# Altium project KaRadioWired.PrjPcb (part 1 of 2)
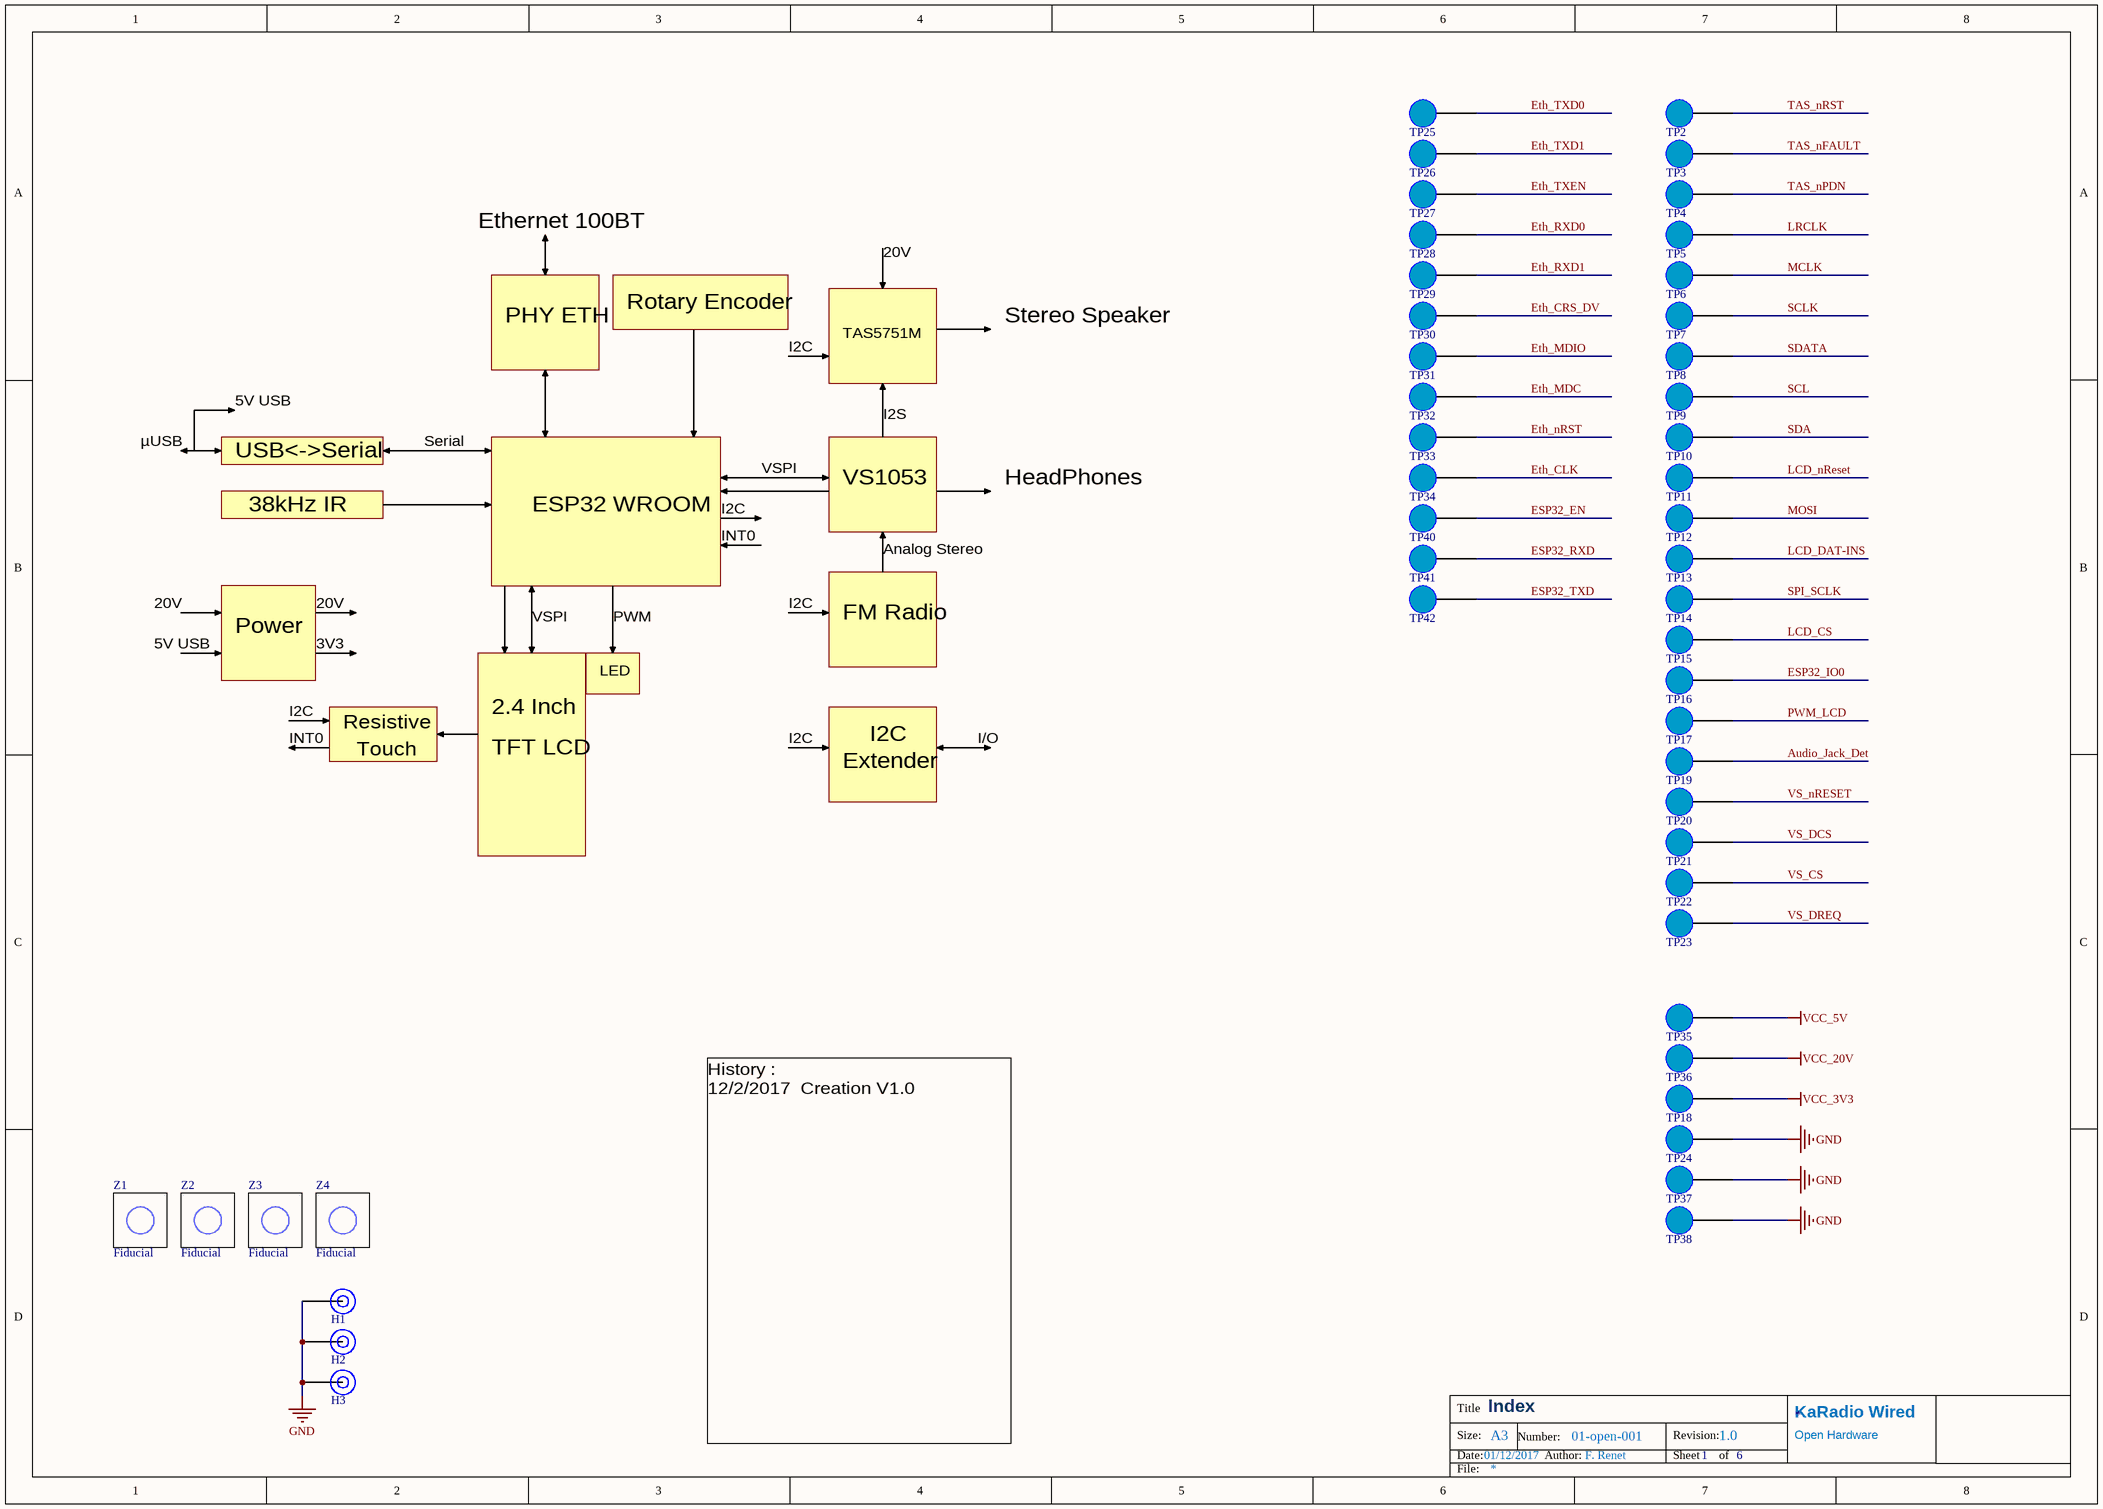
[diagram p0: 00-INDEX.SchDoc]
Organisation: APTUSTECH; ProjectAuthor: F. Renet; ProjectDate: 01/12/2017; ProjectName: KaRadio Wired; ProjectNumber: 01-open-001; ProjectRevision: 1.0; ProjectSubtitle: Open Hardware; ProjectTitle: KaRadio Wired
6 sheets, 271 parts. Net scope: global (net labels, ports and power ports of the same name join across sheets).
Board file: KaRadioWired.PcbDoc
Sheets:
  00-INDEX.SchDoc
  01-Amplifier.SchDoc
  02-ESP-WROOM-32.SchDoc
  03-VS1053B.SchDoc
  04-Ethernet.SchDoc
  05-Power.SchDoc

## Sheet 00-INDEX.SchDoc: Index
size A3; SheetNumber: 1; SheetTotal: 6

### Parts
H1  Hole_Screw_3mm  [Hole_3.2mm]  (value not drawn)  (no BOM)
H2  Hole_Screw_3mm  [Hole_3.2mm]  (value not drawn)  (no BOM)
H3  Hole_Screw_3mm  [Hole_3.2mm]  (value not drawn)  (no BOM)
TP2  TP_1mm  [TP_1mm]  (value not drawn)  (no BOM)
TP3  TP_1mm  [TP_1mm]  (value not drawn)  (no BOM)
TP4  TP_1mm  [TP_1mm]  (value not drawn)  (no BOM)
TP5  TP_1mm  [TP_1mm]  (value not drawn)  (no BOM)
TP6  TP_1mm  [TP_1mm]  (value not drawn)  (no BOM)
TP7  TP_1mm  [TP_1mm]  (value not drawn)  (no BOM)
TP8  TP_1mm  [TP_1mm]  (value not drawn)  (no BOM)
TP9  TP_1mm  [TP_1mm]  (value not drawn)  (no BOM)
TP10  TP_1mm  [TP_1mm]  (value not drawn)  (no BOM)
TP11  TP_1mm  [TP_1mm]  (value not drawn)  (no BOM)
TP12  TP_1mm  [TP_1mm]  (value not drawn)  (no BOM)
TP13  TP_1mm  [TP_1mm]  (value not drawn)  (no BOM)
TP14  TP_1mm  [TP_1mm]  (value not drawn)  (no BOM)
TP15  TP_1mm  [TP_1mm]  (value not drawn)  (no BOM)
TP16  TP_1mm  [TP_1mm]  (value not drawn)  (no BOM)
TP17  TP_1mm  [TP_1mm]  (value not drawn)  (no BOM)
TP18  TP_1mm  [TP_1mm]  (value not drawn)  (no BOM)
TP19  TP_1mm  [TP_1mm]  (value not drawn)  (no BOM)
TP20  TP_1mm  [TP_1mm]  (value not drawn)  (no BOM)
TP21  TP_1mm  [TP_1mm]  (value not drawn)  (no BOM)
TP22  TP_1mm  [TP_1mm]  (value not drawn)  (no BOM)
TP23  TP_1mm  [TP_1mm]  (value not drawn)  (no BOM)
TP24  TP_1mm  [TP_1mm]  (value not drawn)  (no BOM)
TP25  TP_1mm  [TP_1mm]  (value not drawn)  (no BOM)
TP26  TP_1mm  [TP_1mm]  (value not drawn)  (no BOM)
TP27  TP_1mm  [TP_1mm]  (value not drawn)  (no BOM)
TP28  TP_1mm  [TP_1mm]  (value not drawn)  (no BOM)
TP29  TP_1mm  [TP_1mm]  (value not drawn)  (no BOM)
TP30  TP_1mm  [TP_1mm]  (value not drawn)  (no BOM)
TP31  TP_1mm  [TP_1mm]  (value not drawn)  (no BOM)
TP32  TP_1mm  [TP_1mm]  (value not drawn)  (no BOM)
TP33  TP_1mm  [TP_1mm]  (value not drawn)  (no BOM)
TP34  TP_1mm  [TP_1mm]  (value not drawn)  (no BOM)
TP35  TP_1mm  [TP_1mm]  (value not drawn)  (no BOM)
TP36  TP_1mm  [TP_1mm]  (value not drawn)  (no BOM)
TP37  TP_1mm  [TP_1mm]  (value not drawn)  (no BOM)
TP38  TP_1mm  [TP_1mm]  (value not drawn)  (no BOM)
TP40  TP_1mm  [TP_1mm]  (value not drawn)  (no BOM)
TP41  TP_1mm  [TP_1mm]  (value not drawn)  (no BOM)
TP42  TP_1mm  [TP_1mm]  (value not drawn)  (no BOM)
Z1  Fiducial  [Fiducial_1mm]  (no BOM)
Z2  Fiducial  [Fiducial_1mm]  (no BOM)
Z3  Fiducial  [Fiducial_1mm]  (no BOM)
Z4  Fiducial  [Fiducial_1mm]  (no BOM)

### Nets
GND: H1.1 H2.1 H3.1 TP24.1 TP37.1 TP38.1
VCC_3V3: TP18.1
VCC_5V: TP35.1
VCC_20V: TP36.1
Audio_Jack_Det: TP19.1
ESP32_EN: TP40.1
ESP32_IO0: TP16.1
ESP32_RXD: TP41.1
ESP32_TXD: TP42.1
Eth_CLK: TP34.1
Eth_CRS_DV: TP30.1
Eth_MDC: TP32.1
Eth_MDIO: TP31.1
Eth_nRST: TP33.1
Eth_RXD0: TP28.1
Eth_RXD1: TP29.1
Eth_TXD0: TP25.1
Eth_TXD1: TP26.1
Eth_TXEN: TP27.1
LCD_CS: TP15.1
LCD_DAT-INS: TP13.1
LCD_nReset: TP11.1
LRCLK: TP5.1
MCLK: TP6.1
MOSI: TP12.1
PWM_LCD: TP17.1
SCL: TP9.1
SCLK: TP7.1
SDA: TP10.1
SDATA: TP8.1
SPI_SCLK: TP14.1
TAS_nFAULT: TP3.1
TAS_nPDN: TP4.1
TAS_nRST: TP2.1
VS_CS: TP22.1
VS_DCS: TP21.1
VS_DREQ: TP23.1
VS_nRESET: TP20.1

### Notes on the sheet
- Ethernet 100BT
- Rotary Encoder
- 20V
- PHY ETH
- I2C
- TAS5751M
- Stereo Speaker
- µUSB
- 5V USB
- Serial
- I2S
- USB<->Serial
- 38kHz IR
- ESP32 WROOM
- VSPI
- VS1053
- HeadPhones
- INT0
- Analog Stereo
- Power
- 3V3
- PWM
- FM Radio
- 2.4 Inch
- LED
- Resistive
- Touch
- TFT LCD
- Extender
- I/O
- History :
  12/2/2017  Creation V1.0
- Title
- Size:
- Date:
- A3
- Number:
- Author:
- Revision:
- Sheet
- of
- File:

### Library data of the parts
H1-H3 = Hole_Screw_3mm: Fix hole 3mm screw
TP2-TP38 TP40-TP42 = TP_1mm: Test point 1mm round SMD
Z1-Z4 = Fiducial: 1mm Fiducial

## Sheet 01-Amplifier.SchDoc: Amplifier TAS5751M
size A3; SheetNumber: 2; SheetTotal: 6
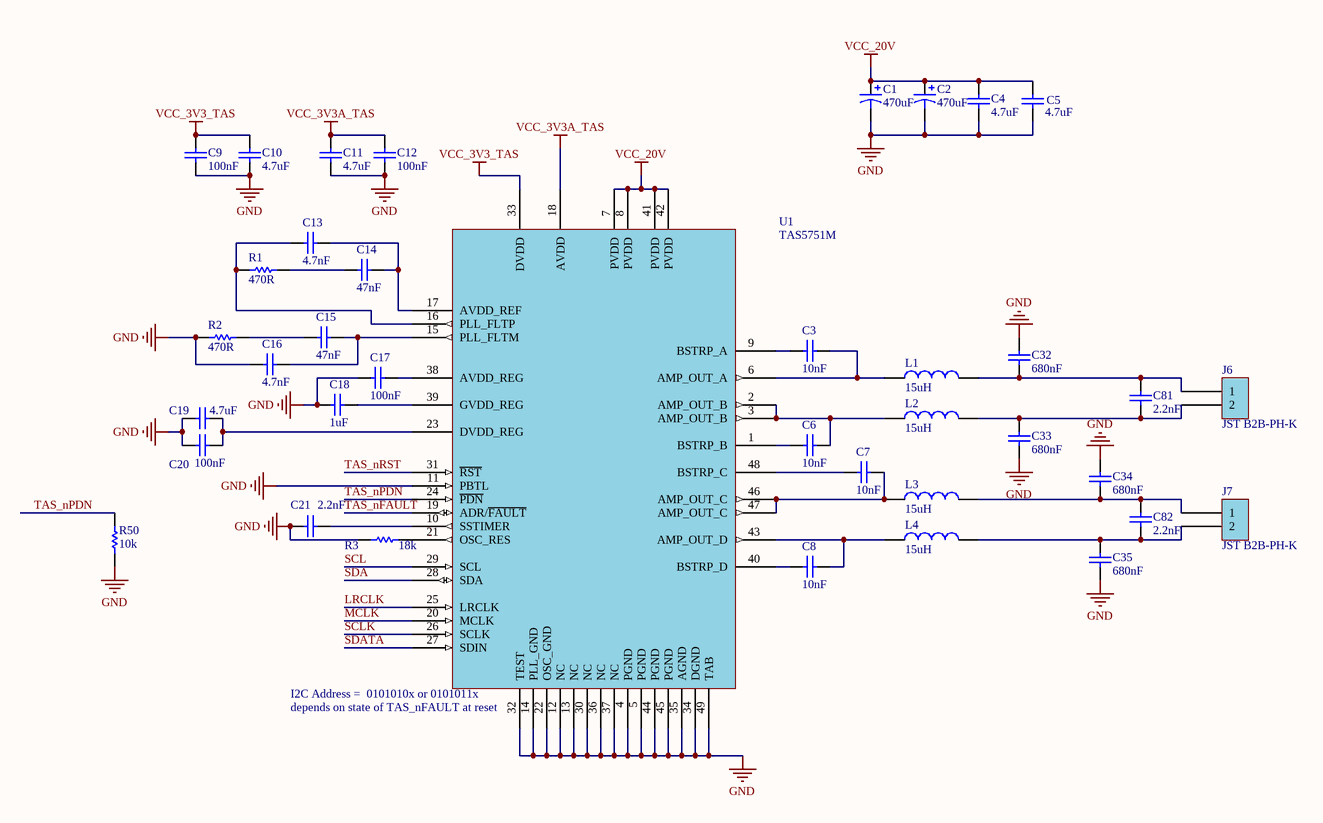
[diagram p1: 01-Amplifier.SchDoc]

### Parts
C1  value 470uF  [Cap_POL_10mm_12.5mm_TH]  (hidden comment: 470uF 25V)
C2  value 470uF  [Cap_POL_10mm_12.5mm_TH]  (hidden comment: 470uF 25V)
C3  value 10nF  [CAPC3216X16N]  (hidden comment: 10nF 50V 1206 X7R)
C4  value 4.7uF  [CAPC3216X16N]  (hidden comment: 4.7uF 50V 1206 X5R)
C5  value 4.7uF  [CAPC3216X16N]  (hidden comment: 4.7uF 50V 1206 X5R)
C6  value 10nF  [CAPC3216X16N]  (hidden comment: 10nF 50V 1206 X7R)
C7  value 10nF  [CAPC3216X16N]  (hidden comment: 10nF 50V 1206 X7R)
C8  value 10nF  [CAPC3216X16N]  (hidden comment: 10nF 50V 1206 X7R)
C9  value 100nF  [CAPC1608X06N]  (hidden comment: 100nF 25V 0603 X5R)
C10  value 4.7uF  [CAPC1608X06N]  (hidden comment: 4.7uF 10V 0603 X5R)
C11  value 4.7uF  [CAPC1608X06N]  (hidden comment: 4.7uF 10V 0603 X5R)
C12  value 100nF  [CAPC1608X06N]  (hidden comment: 100nF 25V 0603 X5R)
C13  value 4.7nF  [CAPC1608X06N]  (hidden comment: 4.7nF 50V 0603 X7R)
C14  value 47nF  [CAPC1608X06N]  (hidden comment: 47nF 50V 0603 X7R)
C15  value 47nF  [CAPC1608X06N]  (hidden comment: 47nF 50V 0603 X7R)
C16  value 4.7nF  [CAPC1608X06N]  (hidden comment: 4.7nF 50V 0603 X7R)
C17  value 100nF  [CAPC1608X06N]  (hidden comment: 100nF 25V 0603 X5R)
C18  value 1uF  [CAPC1608X06N]  (hidden comment: 1uF 16V 0603 X7R)
C19  value 4.7uF  [CAPC1608X06N]  (hidden comment: 4.7uF 10V 0603 X5R)
C20  value 100nF  [CAPC1608X06N]  (hidden comment: 100nF 25V 0603 X5R)
C21  value 2.2nF  [CAPC1608X06N]  (hidden comment: 2.2nF 50V 0603 X7R)
C32  value 680nF  [CAPC3216X16N]  (hidden comment: 680nF 50V 1206 C0G)
C33  value 680nF  [CAPC3216X16N]  (hidden comment: 680nF 50V 1206 C0G)
C34  value 680nF  [CAPC3216X16N]  (hidden comment: 680nF 50V 1206 C0G)
C35  value 680nF  [CAPC3216X16N]  (hidden comment: 680nF 50V 1206 C0G)
C81  value 2.2nF  [CAPC1608X06N]  (hidden comment: 2.2nF 50V 0603 X7R)
C82  value 2.2nF  [CAPC1608X06N]  (hidden comment: 2.2nF 50V 0603 X7R)
J6  JST B2B-PH-K  [JST B2B-PH-K]
J7  JST B2B-PH-K  [JST B2B-PH-K]
L1  value 15uH  [1255AY]  (hidden comment: 1255AY-150M)
L2  value 15uH  [1255AY]  (hidden comment: 1255AY-150M)
L3  value 15uH  [1255AY]  (hidden comment: 1255AY-150M)
L4  value 15uH  [1255AY]  (hidden comment: 1255AY-150M)
R1  value 470R  [RESC1608X06N]  (hidden comment: 470R_0603)
R2  value 470R  [RESC1608X06N]  (hidden comment: 470R_0603)
R3  value 18k  [RESC1608X06N]  (hidden comment: 18k_0603)
R50  value 10k  [RESC1608X06N]  (hidden comment: 10k_0603)
U1  TAS5751M  [TSSOP50P810X120_HS-49M]

### Nets
GND: C1.2 C2.2 C4.1 C5.1 C9.1 C10.1 C11.1 C12.1 C16.1 C17.2 C18.1 C19.2 C20.2 C21.1 C32.1 C33.1 C34.1 C35.1 R2.1 R3.1 R50.2 U1.4(PGND) U1.5(PGND) U1.11(PBTL) U1.12(NC) U1.13(NC) U1.14(PLL_GND) U1.22(OSC_GND) U1.30(NC) U1.32(TEST) U1.34(DGND) U1.35(AGND) U1.36(NC) U1.37(NC) U1.44(PGND) U1.45(PGND) U1.49(TAB)
VCC_3V3_TAS: C9.2 C10.2 U1.33(DVDD)
VCC_3V3A_TAS: C11.2 C12.2 U1.18(AVDD)
VCC_20V: C1.1 C2.1 C4.2 C5.2 U1.7(PVDD) U1.8(PVDD) U1.41(PVDD) U1.42(PVDD)
LRCLK: U1.25(LRCLK)
MCLK: U1.20(MCLK)
SCL: U1.29(SCL)
SCLK: U1.26(SCLK)
SDA: U1.28(SDA)
SDATA: U1.27(SDIN)
TAS_nFAULT: U1.19(ADR/~{FAULT})
TAS_nPDN: R50.1 U1.24(~{PDN})
TAS_nRST: U1.31(~{RST})
NetC3_1: C3.1 U1.9(BSTRP_A)
NetC3_2: C3.2 L1.1 U1.6(AMP_OUT_A)
NetC6_1: C6.1 U1.1(BSTRP_B)
NetC6_2: C6.2 L2.1 U1.2(AMP_OUT_B) U1.3(AMP_OUT_B)
NetC7_1: C7.1 U1.48(BSTRP_C)
NetC7_2: C7.2 L3.1 U1.46(AMP_OUT_C) U1.47(AMP_OUT_C)
NetC8_1: C8.1 U1.40(BSTRP_D)
NetC8_2: C8.2 L4.1 U1.43(AMP_OUT_D)
NetC13_1: C13.1 R1.1 U1.16(PLL_FLTP)
NetC13_2: C13.2 C14.2 U1.17(AVDD_REF)
NetC14_1: C14.1 R1.2
NetC15_1: C15.1 R2.2
NetC15_2: C15.2 C16.2 U1.15(PLL_FLTM)
NetC17_1: C17.1 U1.38(AVDD_REG)
NetC18_2: C18.2 U1.39(GVDD_REG)
NetC19_1: C19.1 C20.1 U1.23(DVDD_REG)
NetC21_2: C21.2 U1.10(SSTIMER)
NetC32_2: C32.2 C81.2 J6.1 L1.2
NetC33_2: C33.2 C81.1 J6.2 L2.2
NetC34_2: C34.2 C82.2 J7.1 L3.2
NetC35_2: C35.2 C82.1 J7.2 L4.2
NetR3_2: R3.2 U1.21(OSC_RES)

### Notes on the sheet
- (near U1) I2C Address =  0101010x or 0101011x
- (near U1) depends on state of TAS_nFAULT at reset
- Title
- Size:
- Date:
- A3
- Number:
- Author:
- Revision:
- Sheet
- of
- File:

### Library data of the parts
C1 C2 = 470uF 25V 10mm 12.5mm: Aluminum Capacitor 470uF 25V TH 10mm 12.5mm; PartNumber: EKZN250ELL471MJC5S; Manufacturer: United Chemi-Con; Tolerance: 20%; Voltage: 25V; Supplier1: Mouser; RefSupplier1: 661-EKZN250E471MJC5S
C3 C6-C8 = 10nF 50V 1206 X7R: Tolerance: 10%; Voltage: 50V; Supplier1: Digikey; Supplier2: Mouser; Supplier3: Farnell; RefSupplier1: 478-1542-1-ND; RefSupplier2: *; RefSupplier3: *; Case: 1206; Material: X7R
C4 C5 = 4.7uF 50V 1206 X5R: Tolerance: 10%; Voltage: 50V; Supplier1: Digikey; Supplier2: Mouser; Supplier3: Farnell; RefSupplier1: 587-2994-1-ND; RefSupplier2: *; RefSupplier3: *; Case: 1206; Material: X5R
C9 C12 C17 C20 = 100nF 25V 0603 X5R: Tolerance: 10%; Voltage: 25V; Supplier1: Digikey; Supplier2: Mouser; Supplier3: Farnell; RefSupplier1: 587-1245-1-ND; RefSupplier2: *; RefSupplier3: *; Case: 0603; Material: X5R
C10 C11 C19 = 4.7uF 10V 0603 X5R: Tolerance: 10%; Voltage: 10V; Supplier1: Digikey; Supplier2: Mouser; Supplier3: Farnell; RefSupplier1: 1276-6684-1-ND; RefSupplier2: *; RefSupplier3: *; Case: 0603; Material: X5R
C13 C16 = 4.7nF 50V 0603 X7R: Tolerance: 10%; Voltage: 50V; Supplier1: Digikey; Supplier2: Mouser; Supplier3: Farnell; RefSupplier1: 490-12741-1-ND; RefSupplier2: *; RefSupplier3: *; Case: 0603; Material: X7R
C14 C15 = 47nF 50V 0603 X7R: Tolerance: 10%; Voltage: 50V; Supplier1: Digikey; Supplier2: Mouser; Supplier3: Farnell; RefSupplier1: 1276-1063-1-ND; RefSupplier2: *; RefSupplier3: *; Case: 0603; Material: X7R
C18 = 1uF 16V 0603 X7R: Tolerance: 10%; Voltage: 16V; Supplier1: Digikey; Supplier2: Mouser; Supplier3: Farnell; RefSupplier1: EMK107B7105KA-T; RefSupplier2: *; RefSupplier3: *; Case: 0603; Material: X7R
C21 C81 C82 = 2.2nF 50V 0603 X7R: Tolerance: 10%; Voltage: 50V; Supplier1: Digikey; Supplier2: Mouser; Supplier3: Farnell; RefSupplier1: 1276-6530-1-ND; RefSupplier2: *; RefSupplier3: *; Case: 0603; Material: X7R
C32-C35 = 680nF 50V 1206 C0G: Tolerance: 10%; Voltage: 50V; Supplier1: Digikey; Supplier2: Mouser; Supplier3: Farnell; RefSupplier1: 1276-2849-1-ND; RefSupplier2: *; RefSupplier3: *; Case: 1206; Material: C0G
L1-L4 = 1255AY-150M: Manufacturer: Murata; Rated Current: 2.4A; PartNumber: 1255AY-150M; Case: 2424; Supplier1: Digikey; Supplier2: Mouser; Supplier3: Farnell; RefSupplier2: *; RefSupplier3: *
R1 R2 = 470R: Resistor 470R 0603 1%; Case: 0603; Tolerance: 1%; Size: 0603, 1.6x0.8x0.8mm; Supplier1: Digikey; Supplier2: *; Supplier3: *; RefSupplier1: 311-470HRCT-ND; RefSupplier2: *; RefSupplier3: *
R3 = 18k: Resistor 18k 0603 1%; Case: 0603; Tolerance: 1%; Size: 0603, 1.6x0.8x0.8mm; RefSupplier1: 311-18.0KHRCT-ND; RefSupplier2: *; RefSupplier3: *; Supplier1: Digikey; Supplier2: *; Supplier3: *
R50 = 10k: Resistor 10k 0603 1%; Case: 0603; Tolerance: 1%; Size: 0603, 1.6x0.8x0.8mm; RefSupplier1: 311-10.0KHRCT-ND; RefSupplier2: *; RefSupplier3: *; Supplier1: Digikey; Supplier2: *; Supplier3: *
U1 = TAS5751M: TAS5751M - Digital Input Audio Power Amplifier with EQ and 3-Band AGL; Manufacturer: TI; PartNumber: TAS5751M; Case: TSSOP48
J6 J7 = JST B2B-PH-K: PartNumber: B2B-PH-K; Manufacturer: JST

## Sheet 02-ESP-WROOM-32.SchDoc: ESP32, LCD, I2C IOs  and USB
size A3; SheetNumber: 3; SheetTotal: 6
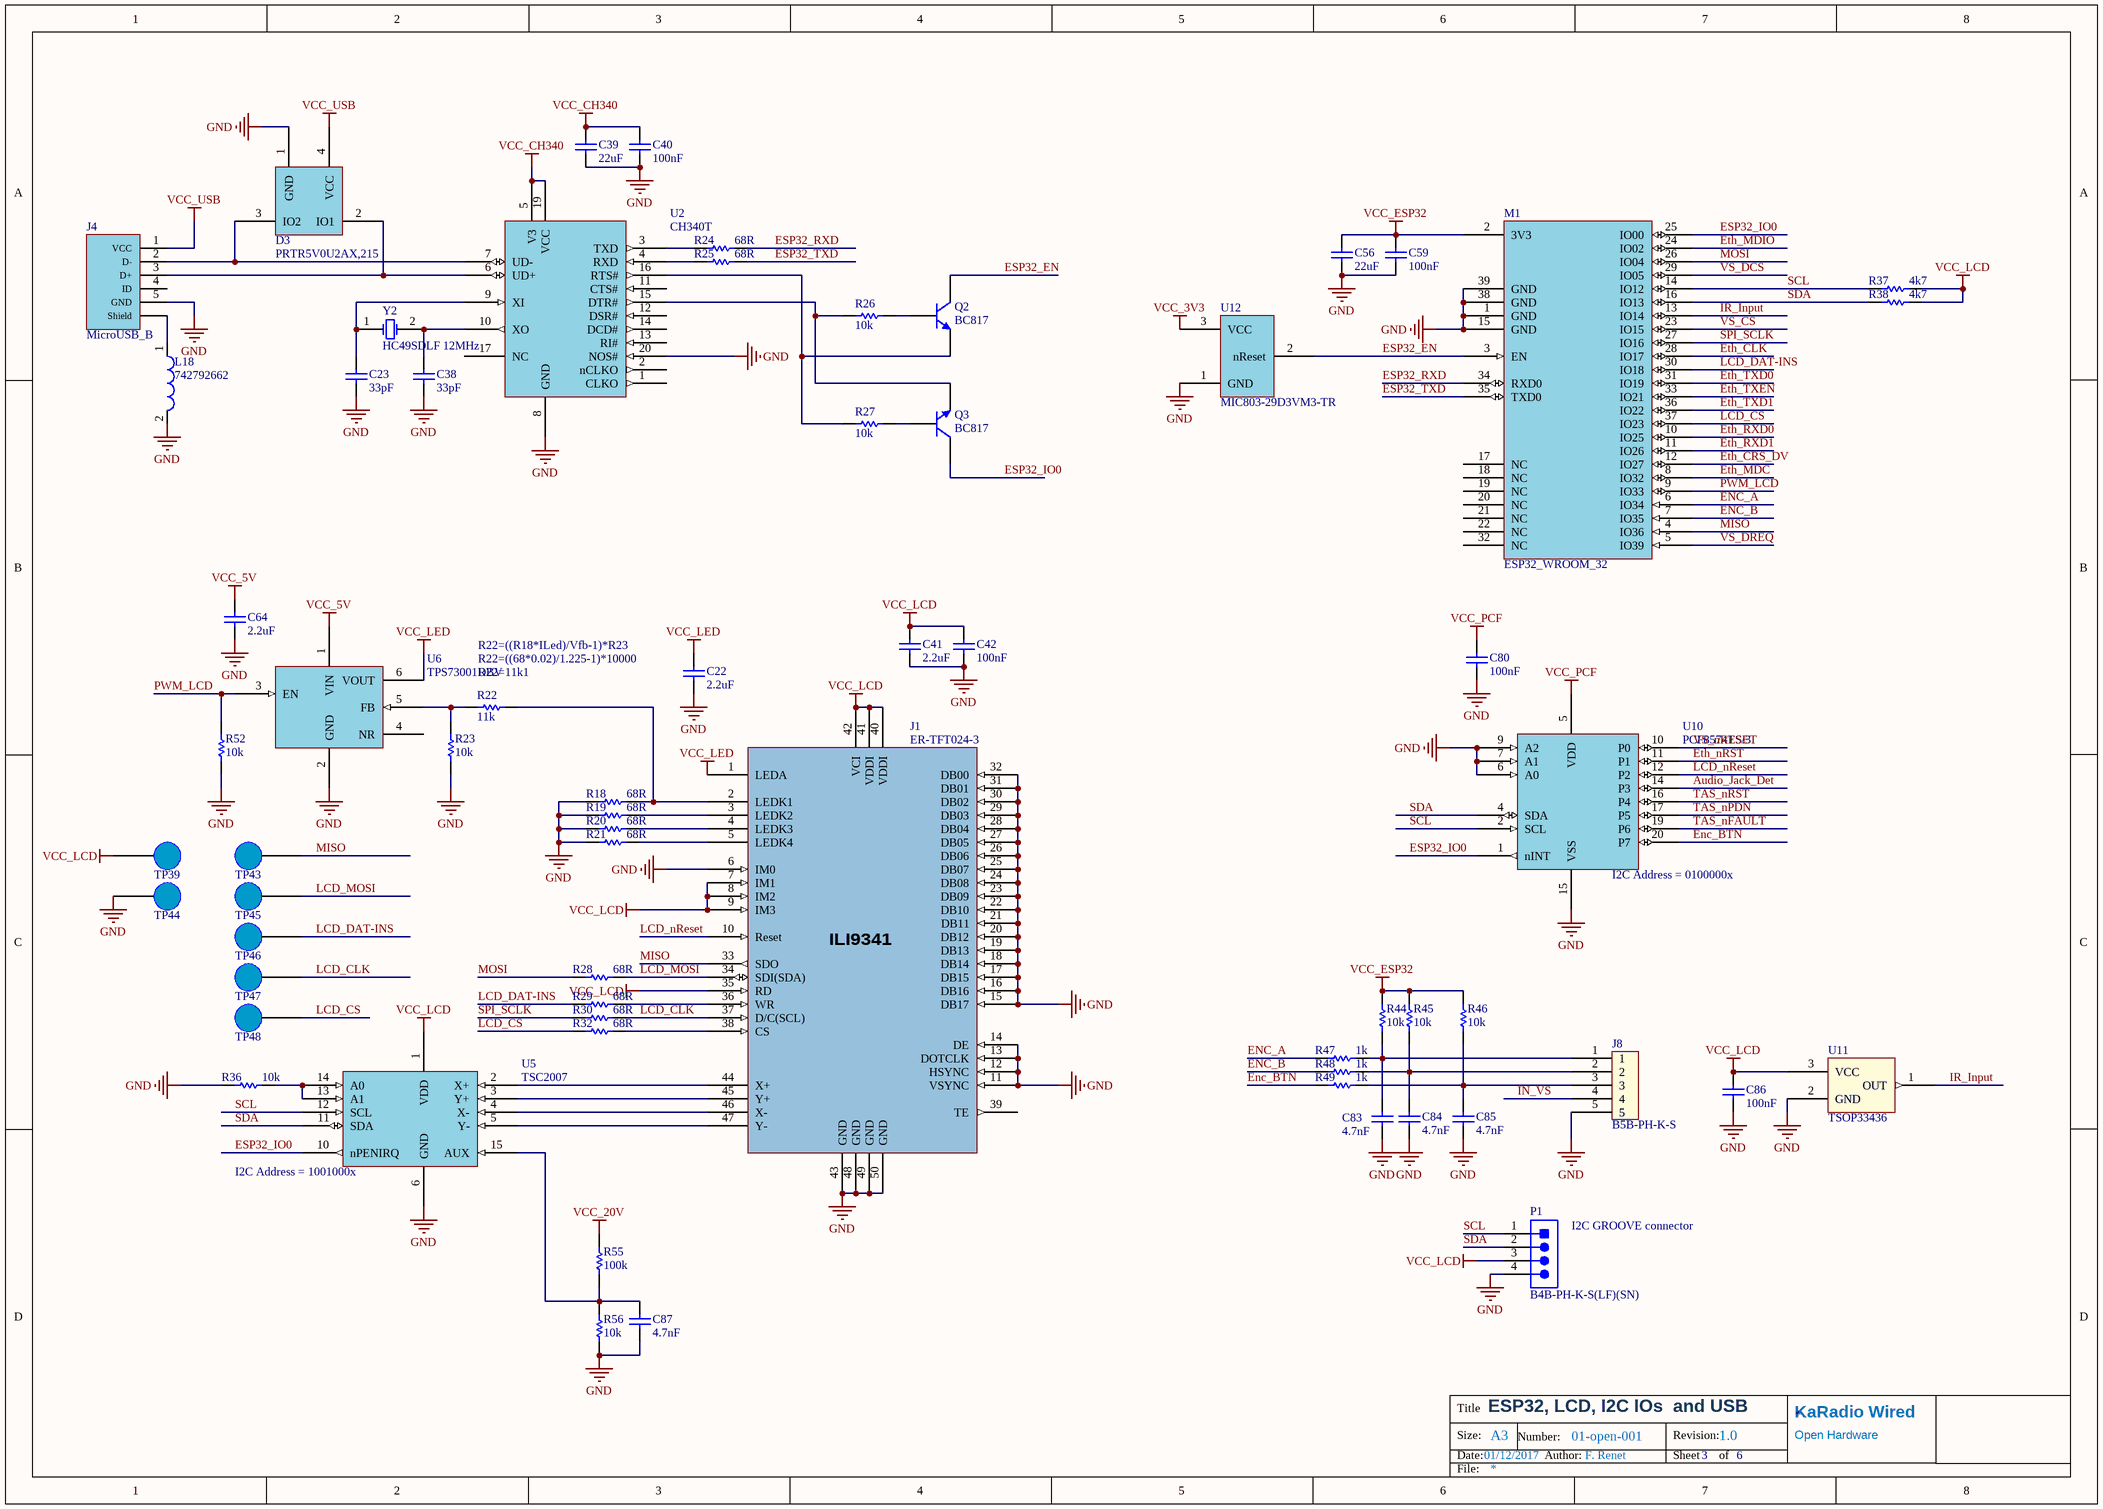
[diagram p2: 02-ESP-WROOM-32.SchDoc]

### Parts
C22  value 2.2uF  [CAPC1608X06N]  (hidden comment: 2.2uF 10V 0603 X5R)
C23  value 33pF  [CAPC1608X06N]  (hidden comment: 33pF 50V 0603 NP0)
C38  value 33pF  [CAPC1608X06N]  (hidden comment: 33pF 50V 0603 NP0)
C39  value 22uF  [CAPC1608X06N]  (hidden comment: 22uF 6.3V 0603 X5R)
C40  value 100nF  [CAPC1608X06N]  (hidden comment: 100nF 25V 0603 X5R)
C41  value 2.2uF  [CAPC1608X06N]  (hidden comment: 2.2uF 10V 0603 X5R)
C42  value 100nF  [CAPC1608X06N]  (hidden comment: 100nF 25V 0603 X5R)
C56  value 22uF  [CAPC1608X06N]  (hidden comment: 22uF 6.3V 0603 X5R)
C59  value 100nF  [CAPC1608X06N]  (hidden comment: 100nF 25V 0603 X5R)
C64  value 2.2uF  [CAPC1608X06N]  (hidden comment: 2.2uF 10V 0603 X5R)
C80  value 100nF  [CAPC1608X06N]  (hidden comment: 100nF 25V 0603 X5R)
C83  value 4.7nF  [CAPC1608X06N]  (hidden comment: 4.7nF 50V 0603 X7R)
C84  value 4.7nF  [CAPC1608X06N]  (hidden comment: 4.7nF 50V 0603 X7R)
C85  value 4.7nF  [CAPC1608X06N]  (hidden comment: 4.7nF 50V 0603 X7R)
C86  value 100nF  [CAPC1608X06N]  (hidden comment: 100nF 25V 0603 X5R)
C87  value 4.7nF  [CAPC1608X06N]  (hidden comment: 4.7nF 50V 0603 X7R)
D3  PRTR5V0U2AX,215  [SOT190P230X120-4N]
J1  ER-TFT024-3  [62684-501100ALF]
J4  MicroUSB_B  [629105150521]
J8  B5B-PH-K-S  [JST-B5B-PH-K-S_V]
L18  742792662  [CAPC0603(1608)]
M1  ESP32_WROOM_32  [ESP-WROOM-32]
P1  B4B-PH-K-S(LF)(SN)  [JST-B4B-PH-K-S_V]
Q2  BC817  [SOT95P230X110-3N]
Q3  BC817  [SOT95P230X110-3N]
R18  value 68R  [RESC1608X06N]  (hidden comment: 68R_0603)
R19  value 68R  [RESC1608X06N]  (hidden comment: 68R_0603)
R20  value 68R  [RESC1608X06N]  (hidden comment: 68R_0603)
R21  value 68R  [RESC1608X06N]  (hidden comment: 68R_0603)
R22  value 11k  [RESC1608X06N]  (hidden comment: 11k_0603)
R23  value 10k  [RESC1608X06N]  (hidden comment: 10k_0603)
R24  value 68R  [RESC1608X06N]  (hidden comment: 68R_0603)
R25  value 68R  [RESC1608X06N]  (hidden comment: 68R_0603)
R26  value 10k  [RESC1608X06N]  (hidden comment: 10k_0603)
R27  value 10k  [RESC1608X06N]  (hidden comment: 10k_0603)
R28  value 68R  [RESC1608X06N]  (hidden comment: 68R_0603)
R29  value 68R  [RESC1608X06N]  (hidden comment: 68R_0603)
R30  value 68R  [RESC1608X06N]  (hidden comment: 68R_0603)
R32  value 68R  [RESC1608X06N]  (hidden comment: 68R_0603)
R36  value 10k  [RESC1608X06N]  (hidden comment: 10k_0603)
R37  value 4k7  [RESC1608X06N]  (hidden comment: 4k7_0603)
R38  value 4k7  [RESC1608X06N]  (hidden comment: 4k7_0603)
R44  value 10k  [RESC1608X06N]  (hidden comment: 10k_0603)
R45  value 10k  [RESC1608X06N]  (hidden comment: 10k_0603)
R46  value 10k  [RESC1608X06N]  (hidden comment: 10k_0603)
R47  value 1k  [RESC1608X06N]  (hidden comment: 1k_0603)
R48  value 1k  [RESC1608X06N]  (hidden comment: 1k_0603)
R49  value 1k  [RESC1608X06N]  (hidden comment: 1k_0603)
R52  value 10k  [RESC1608X06N]  (hidden comment: 10k_0603)
R55  value 100k  [RESC1608X06N]  (hidden comment: 100k_0603)
R56  value 10k  [RESC1608X06N]  (hidden comment: 10k_0603)
TP39  TP_1mm  [TP_1mm]  (value not drawn)  (no BOM)
TP43  TP_1mm  [TP_1mm]  (value not drawn)  (no BOM)
TP44  TP_1mm  [TP_1mm]  (value not drawn)  (no BOM)
TP45  TP_1mm  [TP_1mm]  (value not drawn)  (no BOM)
TP46  TP_1mm  [TP_1mm]  (value not drawn)  (no BOM)
TP47  TP_1mm  [TP_1mm]  (value not drawn)  (no BOM)
TP48  TP_1mm  [TP_1mm]  (value not drawn)  (no BOM)
U2  CH340T  [TSOP65P780X120-20N]
U5  TSC2007  [TSOP65P640X120-16N]
U6  TPS73001DBV  [SOT95P245X110-6N]
U10  PCF8574TS/3  [TSOP65P640X120-20N]
U11  TSOP33436  [TSOP332]
U12  MIC803-29D3VM3-TR  [SOT95P230X110-3N]
Y2  HC49SDLF 12MHz  [TXC 9C]

### Nets
GND: C22.1 C23.1 C38.1 C39.2 C40.2 C41.1 C42.2 C56.2 C59.2 C64.1 C80.2 C83.1 C84.1 C85.1 C86.2 C87.1 D3.1(GND) J1.6(IM0) J1.11(VSYNC) J1.12(HSYNC) J1.13(DOTCLK) J1.14(DE) J1.15(DB17) J1.16(DB16) J1.17(DB15) J1.18(DB14) J1.19(DB13) J1.20(DB12) J1.21(DB11) J1.22(DB10) J1.23(DB09) J1.24(DB08) J1.25(DB07) J1.26(DB06) J1.27(DB05) J1.28(DB04) J1.29(DB03) J1.30(DB02) J1.31(DB01) J1.32(DB00) J1.43(GND) J1.48(GND) J1.49(GND) J1.50(GND) J4.5(GND) J8.5 L18.2 M1.1(GND) M1.15(GND) M1.38(GND) M1.39(GND) P1.4 R18.1 R19.1 R20.1 R21.1 R23.1 R36.2 R52.1 R56.1 TP44.1 U2.8(GND) U2.20(NOS#) U5.6(GND) U6.2(GND) U10.6(A0) U10.7(A1) U10.9(A2) U10.15(VSS) U11.2(GND) U12.1(GND)
VCC_3V3: U12.3(VCC)
VCC_5V: C64.2 U6.1(VIN)
VCC_20V: R55.2
VCC_CH340: C39.1 C40.1 U2.5(V3) U2.19(VCC)
VCC_ESP32: C56.1 C59.1 M1.2(3V3) R44.2 R45.2 R46.2
VCC_LCD: C41.2 C42.1 C86.1 J1.7(IM1) J1.8(IM2) J1.9(IM3) J1.35(RD) J1.40(VDDI) J1.41(VDDI) J1.42(VCI) P1.3 R37.2 R38.2 TP39.1 U5.1(VDD) U11.3(VCC)
VCC_LED: C22.2 J1.1(LEDA) U6.6(VOUT)
VCC_PCF: C80.1 U10.5(VDD)
VCC_USB: D3.4(VCC) J4.1(VCC)
Audio_Jack_Det: U10.14(P3)
ENC_A: M1.6(IO34) R47.1
ENC_B: M1.7(IO35) R48.1
Enc_BTN: R49.1 U10.20(P7)
ESP32_EN: M1.3(EN) Q2.3(C) U12.2(nReset)
ESP32_IO0: M1.25(IO00) Q3.3(C) U5.10(nPENIRQ) U10.1(nINT)
ESP32_RXD: M1.34(RXD0) R24.2
ESP32_TXD: M1.35(TXD0) R25.2
Eth_CLK: M1.28(IO17)
Eth_CRS_DV: M1.12(IO27)
Eth_MDC: M1.8(IO32)
Eth_MDIO: M1.24(IO02)
Eth_nRST: U10.11(P1)
Eth_RXD0: M1.10(IO25)
Eth_RXD1: M1.11(IO26)
Eth_TXD0: M1.31(IO19)
Eth_TXD1: M1.36(IO22)
Eth_TXEN: M1.33(IO21)
IN_VS: J8.4
IR_Input: M1.13(IO14) U11.1(OUT)
LCD_CLK: J1.37(D/C(SCL)) R30.2 TP47.1
LCD_CS: M1.37(IO23) R32.1 TP48.1
LCD_DAT-INS: M1.30(IO18) R29.1 TP46.1
LCD_MOSI: J1.34(SDI(SDA)) R28.2 TP45.1
LCD_nReset: J1.10(Reset) U10.12(P2)
MISO: J1.33(SDO) M1.4(IO36) TP43.1
MOSI: M1.26(IO04) R28.1
PWM_LCD: M1.9(IO33) R52.2 U6.3(EN)
SCL: M1.14(IO12) P1.1 R37.1 U5.12(SCL) U10.2(SCL)
SDA: M1.16(IO13) P1.2 R38.1 U5.11(SDA) U10.4(SDA)
SPI_SCLK: M1.27(IO16) R30.1
TAS_nFAULT: U10.19(P6)
TAS_nPDN: U10.17(P5)
TAS_nRST: U10.16(P4)
VS_CS: M1.23(IO15)
VS_DCS: M1.29(IO05)
VS_DREQ: M1.5(IO39)
VS_nRESET: U10.10(P0)
NetC23_2: C23.2 U2.9(XI) Y2.1(OSC1)
NetC38_2: C38.2 U2.10(XO) Y2.2(OSC2)
NetC83_2: C83.2 J8.1 R44.1 R47.2
NetC84_2: C84.2 J8.2 R45.1 R48.2
NetC85_2: C85.2 J8.3 R46.1 R49.2
NetC87_2: C87.2 R55.1 R56.2 U5.15(AUX)
NetD3_2: D3.2(IO1) J4.3(D+) U2.6(UD+)
NetD3_3: D3.3(IO2) J4.2(D-) U2.7(UD-)
NetJ1_2: J1.2(LEDK1) R18.2 R22.2
NetJ1_3: J1.3(LEDK2) R19.2
NetJ1_4: J1.4(LEDK3) R20.2
NetJ1_5: J1.5(LEDK4) R21.2
NetJ1_36: J1.36(WR) R29.2
NetJ1_38: J1.38(CS) R32.2
NetJ1_44: J1.44(X+) U5.2(X+)
NetJ1_45: J1.45(Y+) U5.3(Y+)
NetJ1_46: J1.46(X-) U5.4(X-)
NetJ1_47: J1.47(Y-) U5.5(Y-)
NetJ4_Shell: J4.Shell(Shield) L18.1
NetQ2_1: Q2.1(B) R26.1
NetQ2_2: Q2.2(E) R27.2 U2.16(RTS#)
NetQ3_1: Q3.1(B) R27.1
NetQ3_2: Q3.2(E) R26.2 U2.15(DTR#)
NetR22_1: R22.1 R23.2 U6.5(FB)
NetR24_1: R24.1 U2.3(TXD)
NetR25_1: R25.1 U2.4(RXD)
NetR36_1: R36.1 U5.13(A1) U5.14(A0)

Not connected (* = marked no-connect by the designer): J1 39(TE); J4 4(ID); M1 17(NC) 18(NC) 19(NC) 20(NC) 21(NC) 22(NC) 32(NC); U2 1(CLKO) 2(nCLKO) 11(CTS#) 12(DSR#) 13(RI#) 14(DCD#) 17(NC); U6 4(NR)

### Notes on the sheet
- R22=((R18*ILed)/Vfb-1)*R23
- R22=((68*0.02)/1.225-1)*10000
- (near R22) R22=11k1
- (near U10) I2C Address = 0100000x
- (near U5) I2C Address = 1001000x
- (near P1) I2C GROOVE connector
- Title
- Size:
- Date:
- A3
- Number:
- Author:
- Revision:
- Sheet
- of
- File:
- (in symbol ER-TFT024-3) ILI9341

### Library data of the parts
C22 C41 C64 = 2.2uF 10V 0603 X5R: Tolerance: 10%; Voltage: 10V; Supplier1: Digikey; Supplier2: Mouser; Supplier3: Farnell; RefSupplier1: 1276-1085-1-ND; RefSupplier2: *; RefSupplier3: *; Case: 0603; Material: X5R
C23 C38 = 33pF 50V 0603 NP0: Tolerance: 10%; Voltage: 50V; Supplier1: Digikey; Supplier2: Mouser; Supplier3: Farnell; RefSupplier1: 490-1415-1-ND; RefSupplier2: *; RefSupplier3: *; Case: 0603; Material: NP0
C39 C56 = 22uF 6.3V 0603 X5R: Tolerance: 10%; Voltage: 6.3V; Supplier1: Digikey; Supplier2: Mouser; Supplier3: Farnell; RefSupplier1: 445-8028-2-ND; RefSupplier2: *; RefSupplier3: *; Case: 0603; Material: X5R
C40 C42 C59 C80 C86 = 100nF 25V 0603 X5R: Tolerance: 10%; Voltage: 25V; Supplier1: Digikey; Supplier2: Mouser; Supplier3: Farnell; RefSupplier1: 587-1245-1-ND; RefSupplier2: *; RefSupplier3: *; Case: 0603; Material: X5R
C83-C85 C87 = 4.7nF 50V 0603 X7R: Tolerance: 10%; Voltage: 50V; Supplier1: Digikey; Supplier2: Mouser; Supplier3: Farnell; RefSupplier1: 490-12741-1-ND; RefSupplier2: *; RefSupplier3: *; Case: 0603; Material: X7R
D3 = PRTR5V0U2AX,215: Ultra low capacitance double rail-to-rail ESD protection diode; Manufacturer: Nexperia; PartNumber: PRTR5V0U2AX,215; Case: SOT-143-B
J1 = ER-TFT024-3: Connector for 240x320 dots 2.4" color tft lcd module; Manufacturer: Amphenol FCI; PartNumber: 62684-501100ALF
J4 = MicroUSB_B: Micro USB 2.0 SMT Type B Horizontal; Manufacturer: Wurth Elektronik; PartNumber: 629105150521
J8 = B5B-PH-K-S: JST  B5B-PH 2mm Pitch 5pins TH; Manufacturer: JST; PartNumber: B5B-PH-K-S
L18 = CMP-0220-00178-1: SMD EMI Suppression Ferrite Bead WE-CBF, Z = 1000 Ohm; Manufacturer: Wurth; PackageDescription: Chip Inductor, 2-Leads, Body 1.6 x 0.8 mm; PackageVersion: 2009; PackageReference: SMD-0603; ComponentLink1URL: http://www.we-online.com; ComponentLink2URL: http://www.we-online.de/katalog/media/pdf/742792662.pdf; Impedance: 1000 Ohm; DatasheetVersion: ver 1, Mar-2010; ComponentLink1Description: Manufacturer Link; ComponentLink2Description: Datasheet; RefManufacturer: 742792662
M1 = ESP32_WROOM_32: Manufacturer: Espressif Systems; PartNumber: ESP32_WROOM_32
P1 = CMP-2000-05165-1: Male Header, Pitch 2 mm, 1 x 4 Position; Manufacturer: JST; No of Positions: 4; Style/Orientation: StraightHeader/Plug; Pitch: 2mm; Datasheet URL: http://datasheet.octopart.com/B4B-PH-K-S%28LF%29%28SN%29-JST-datasheet-10558886.pdf; Type: ShroudedHeader; Manufacturer URL: http://www.jst.com/home2.html; Termination: Crimp; Datasheet Version: Apr-09; PartNumber: B4B-PH-K-S(LF)(SN)
Q2 Q3 = BC817_SOT23: BC817 NPN  45V SOT23; PartNumber: BC817-40,215; Manufacturer: Nexperia; Case: SOT23; Supplier1: Digikey; RefSupplier1: 1727-2919-1-ND
R18-R21 R24 R25 R28-R30 R32 = 68R: Resistor 68R 0603 1%; Case: 0603; Tolerance: 1%; Size: 0603, 1.6x0.8x0.8mm; RefSupplier1: 311-68.0HRCT-ND; RefSupplier2: *; RefSupplier3: *; Supplier1: Digikey; Supplier2: *; Supplier3: *
R22 = 11k: Resistor 11k 0603 1%; Case: 0603; Tolerance: 1%; Size: 0603, 1.6x0.8x0.8mm; RefSupplier1: 311-11KGRCT-ND; RefSupplier2: *; RefSupplier3: *; Supplier1: Digikey; Supplier2: *; Supplier3: *
R23 R26 R27 R36 R44-R46 R52 R56 = 10k: Resistor 10k 0603 1%; Case: 0603; Tolerance: 1%; Size: 0603, 1.6x0.8x0.8mm; RefSupplier1: 311-10.0KHRCT-ND; RefSupplier2: *; RefSupplier3: *; Supplier1: Digikey; Supplier2: *; Supplier3: *
R37 R38 = 4k7: Resistor 4k7 0603 1%; Case: 0603; Tolerance: 1%; Size: 0603, 1.6x0.8x0.8mm; Supplier1: Digikey; Supplier2: *; Supplier3: *; RefSupplier1: 311-4.70KHRCT-ND; RefSupplier2: *; RefSupplier3: *
R47-R49 = 1k: Resistor 1k 0603 1%; Case: 0603; Tolerance: 1%; Size: 0603, 1.6x0.8x0.8mm; Supplier1: Digikey; Supplier2: Mouser; Supplier3: Farnell; RefSupplier1: 311-1.00KHRCT-ND; RefSupplier2: *; RefSupplier3: *
R55 = 100k: Resistor 100k 0603 1%; Case: 0603; Tolerance: 1%; Supplier1: Digikey; Supplier2: *; Supplier3: *; RefSupplier1: 311-100KHRCT-ND; RefSupplier2: *; RefSupplier3: *
TP39 TP43-TP48 = TP_1mm: Test point 1mm round SMD
U2 = CH340T: CH340T USB to Serial; Manufacturer: WCH; PartNumber: CH340T; Case: TSOP20
U5 = TSC2007: TSSOP I2C Resistive Touch Controller; PartNumber: TSC2007IPWR; Manufacturer: TI; Case: TSOP16
U6 = TPS73001DBV: TPS730 ADJ 200mA SOT23-6 LDO; Manufacturer: TI; PartNumber: TPS73001DBV; Case: SOT23-6
U10 = PCF8574TS/3: PCF8574TS/3 SSOP20 I2C I/O Expander; Manufacturer: NXP; PartNumber: PCF8574TS/3; Case: SSOP20
U11 = TSOP33436: TSOP33436 IR 36kHz Receiver; Manufacturer: Vishay; PartNumber: TSOP33436
U12 = MIC803-29D3VM3-TR: Reset 2.93V open drain sot23 MIC803-29D3VM3-TR; Manufacturer: Microchip; PartNumber: MIC803-29D3VM3-TR; Case: SOT23
Y2 = HC49SDLF 12.000MHz: 12.0000MHz Crystal HC49 SMT 20ppm; PartNumber: GC1200052; Manufacturer: Diodes; Value: 12MHz; Tolerance: 20ppm; Supplier1: Digikey; RefSupplier1: GC1200052CT-ND; Case: HC49S

## Sheet 03-VS1053B.SchDoc: VS1053 and FM receiver
size A3; Date: 01/01/2016; Author: Frédéric Renet; Organization: APTUSTECH; Address2: 8 Rue Esperandieu; Address3: 13004 Marseille; Address4: FRANCE; DocumentNumber: 123; Revision: 1.0; SheetNumber: 4; SheetTotal: 6
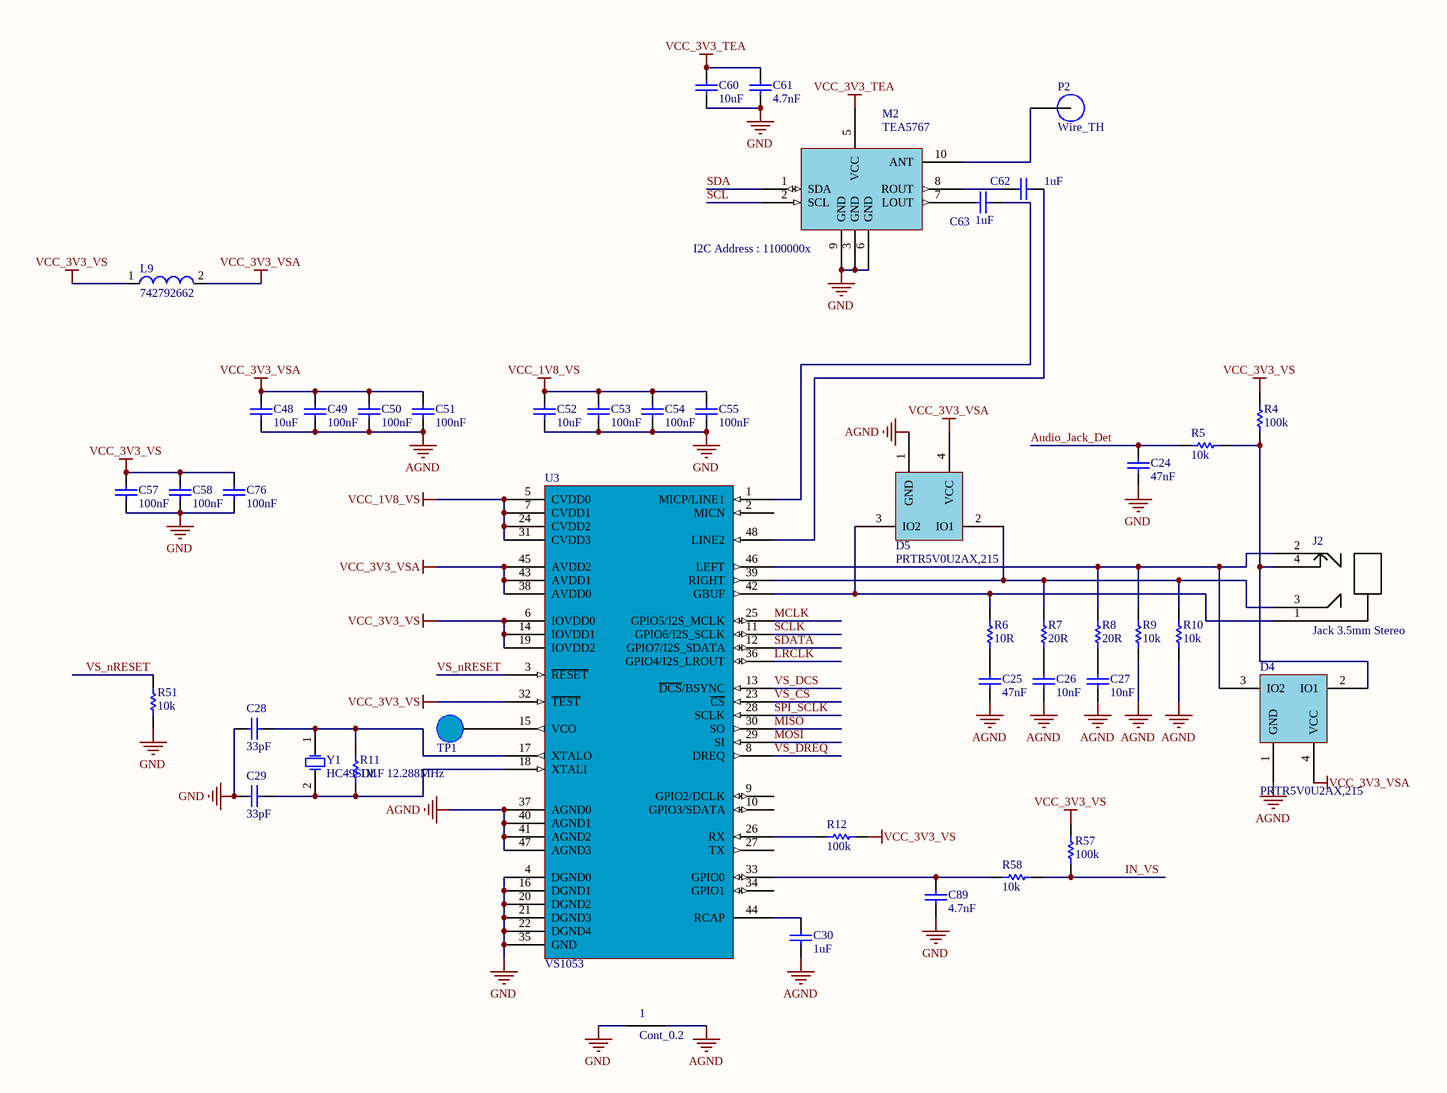
[diagram p3: 03-VS1053B.SchDoc]

### Parts
1  Cont_0.2  [CONT_0.2]  (net tie, no BOM)
C24  value 47nF  [CAPC1608X06N]  (hidden comment: 47nF 50V 0603 X7R)
C25  value 47nF  [CAPC1608X06N]  (hidden comment: 47nF 50V 0603 X7R)
C26  value 10nF  [CAPC1608X06N]  (hidden comment: 10nF 50V 0603 NP0)
C27  value 10nF  [CAPC1608X06N]  (hidden comment: 10nF 50V 0603 NP0)
C28  value 33pF  [CAPC1608X06N]  (hidden comment: 33pF 50V 0603 NP0)
C29  value 33pF  [CAPC1608X06N]  (hidden comment: 33pF 50V 0603 NP0)
C30  value 1uF  [CAPC1608X06N]  (hidden comment: 1uF 16V 0603 X7R)
C48  value 10uF  [CAPC1608X06N]  (hidden comment: 10uF 6.3V 0603 X5R)
C49  value 100nF  [CAPC1608X06N]  (hidden comment: 100nF 25V 0603 X5R)
C50  value 100nF  [CAPC1608X06N]  (hidden comment: 100nF 25V 0603 X5R)
C51  value 100nF  [CAPC1608X06N]  (hidden comment: 100nF 25V 0603 X5R)
C52  value 10uF  [CAPC1608X06N]  (hidden comment: 10uF 6.3V 0603 X5R)
C53  value 100nF  [CAPC1608X06N]  (hidden comment: 100nF 25V 0603 X5R)
C54  value 100nF  [CAPC1608X06N]  (hidden comment: 100nF 25V 0603 X5R)
C55  value 100nF  [CAPC1608X06N]  (hidden comment: 100nF 25V 0603 X5R)
C57  value 100nF  [CAPC1608X06N]  (hidden comment: 100nF 25V 0603 X5R)
C58  value 100nF  [CAPC1608X06N]  (hidden comment: 100nF 25V 0603 X5R)
C60  value 10uF  [CAPC1608X06N]  (hidden comment: 10uF 6.3V 0603 X5R)
C61  value 4.7nF  [CAPC1608X06N]  (hidden comment: 4.7nF 50V 0603 X7R)
C62  value 1uF  [CAPC1608X06N]  (hidden comment: 1uF 16V 0603 X7R)
C63  value 1uF  [CAPC1608X06N]  (hidden comment: 1uF 16V 0603 X7R)
C76  value 100nF  [CAPC1608X06N]  (hidden comment: 100nF 25V 0603 X5R)
C89  value 4.7nF  [CAPC1608X06N]  (hidden comment: 4.7nF 50V 0603 X7R)
D4  PRTR5V0U2AX,215  [SOT190P230X120-4N]
D5  PRTR5V0U2AX,215  [SOT190P230X120-4N]
J2  Jack 3.5mm Stereo  [SJ1-352xng]
L9  742792662  [CAPC0603(1608)]
M2  TEA5767  [MOD_TEA5767]
P2  Wire_TH  [TH_0.8mm]  (no BOM)
R4  value 100k  [RESC1608X06N]  (hidden comment: 100k_0603)
R5  value 10k  [RESC1608X06N]  (hidden comment: 10k_0603)
R6  value 10R  [RESC1608X06N]  (hidden comment: 10R_0603)
R7  value 20R  [RESC1608X06N]  (hidden comment: 20R_0603)
R8  value 20R  [RESC1608X06N]  (hidden comment: 20R_0603)
R9  value 10k  [RESC1608X06N]  (hidden comment: 10k_0603)
R10  value 10k  [RESC1608X06N]  (hidden comment: 10k_0603)
R11  value 1M  [RESC1608X06N]  (hidden comment: 1M_0603)
R12  value 100k  [RESC1608X06N]  (hidden comment: 100k_0603)
R51  value 10k  [RESC1608X06N]  (hidden comment: 10k_0603)
R57  value 100k  [RESC1608X06N]  (hidden comment: 100k_0603)
R58  value 10k  [RESC1608X06N]  (hidden comment: 10k_0603)
TP1  TP_1mm  [TP_1mm]  (value not drawn)  (no BOM)
U3  VS1053  [TSQFP50P900X900X160-48N]
Y1  HC49SDLF 12.288MHz  [TXC 9C]

### Nets
AGND: 1.2 C25.1 C26.1 C27.1 C30.1 C48.1 C49.1 C50.1 C51.1 D4.1(GND) D5.1(GND) R9.2 R10.2 U3.37(AGND0) U3.40(AGND1) U3.41(AGND2) U3.47(AGND3)
GND: 1.1 C24.1 C28.1 C29.1 C52.1 C53.1 C54.1 C55.1 C57.1 C58.1 C60.1 C61.1 C76.1 C89.1 M2.3(GND) M2.6(GND) M2.9(GND) R51.1 U3.4(DGND0) U3.16(DGND1) U3.20(DGND2) U3.21(DGND3) U3.22(DGND4) U3.35(GND)
VCC_1V8_VS: C52.2 C53.2 C54.2 C55.2 U3.5(CVDD0) U3.7(CVDD1) U3.24(CVDD2) U3.31(CVDD3)
VCC_3V3_TEA: C60.2 C61.2 M2.5(VCC)
VCC_3V3_VS: C57.2 C58.2 C76.2 L9.1 R4.2 R12.2 R57.2 U3.6(IOVDD0) U3.14(IOVDD1) U3.19(IOVDD2) U3.32(~{TEST})
VCC_3V3_VSA: C48.2 C49.2 C50.2 C51.2 D4.4(VCC) D5.4(VCC) L9.2 U3.38(AVDD0) U3.43(AVDD1) U3.45(AVDD2)
Audio_Jack_Det: C24.2 R5.1
IN_VS: R57.1 R58.1
LRCLK: U3.36(GPIO4/I2S_LROUT)
MCLK: U3.25(GPIO5/I2S_MCLK)
MISO: U3.30(SO)
MOSI: U3.29(SI)
SCL: M2.2(SCL)
SCLK: U3.11(GPIO6/I2S_SCLK)
SDA: M2.1(SDA)
SDATA: U3.12(GPIO7/I2S_SDATA)
SPI_SCLK: U3.28(SCLK)
VS_CS: U3.23(~{CS})
VS_DCS: U3.13(~{DCS}/BSYNC)
VS_DREQ: U3.8(DREQ)
VS_nRESET: R51.2 U3.3(~{RESET})
NetC25_2: C25.2 R6.1
NetC26_2: C26.2 R7.1
NetC27_2: C27.2 R8.1
NetC28_2: C28.2 R11.2 U3.17(XTALO) Y1.1(OSC1)
NetC29_2: C29.2 R11.1 U3.18(XTALI) Y1.2(OSC2)
NetC30_2: C30.2 U3.44(RCAP)
NetC62_1: C62.1 M2.8(ROUT)
NetC62_2: C62.2 U3.48(LINE2)
NetC63_1: C63.1 M2.7(LOUT)
NetC63_2: C63.2 U3.1(MICP/LINE1)
NetC89_2: C89.2 R58.2 U3.33(GPIO0)
NetD4_2: D4.2(IO1) J2.4 R4.1 R5.2
NetD4_3: D4.3(IO2) J2.2 R8.2 R9.1 U3.46(LEFT)
NetD5_2: D5.2(IO1) J2.3 R7.2 R10.1 U3.39(RIGHT)
NetD5_3: D5.3(IO2) J2.1 R6.2 U3.42(GBUF)
NetM2_10: M2.10(ANT) P2.1
NetR12_1: R12.1 U3.26(RX)
NetTP1_1: TP1.1 U3.15(VCO)

Not connected (* = marked no-connect by the designer): U3 2(MICN) 9(GPIO2/DCLK) 10(GPIO3/SDATA) 27(TX) 34(GPIO1)

### Notes on the sheet
- (near M2) I2C Address : 1100000x
- Title
- Size:
- Date:
- A3
- Number:
- Author:
- Revision:
- Sheet
- of
- File:

### Library data of the parts
1 = Cont_0.2: Split Net Name 0.2mm
C24 C25 = 47nF 50V 0603 X7R: Tolerance: 10%; Voltage: 50V; Supplier1: Digikey; Supplier2: Mouser; Supplier3: Farnell; RefSupplier1: 1276-1063-1-ND; RefSupplier2: *; RefSupplier3: *; Case: 0603; Material: X7R
C26 C27 = 10nF 50V 0603 NP0: Tolerance: 10%; Voltage: 50V; Supplier1: Digikey; Supplier2: Mouser; Supplier3: Farnell; RefSupplier1: 490-9666-1-ND; RefSupplier2: *; RefSupplier3: *; Case: 0603; Material: NP0
C28 C29 = 33pF 50V 0603 NP0: Tolerance: 10%; Voltage: 50V; Supplier1: Digikey; Supplier2: Mouser; Supplier3: Farnell; RefSupplier1: 490-1415-1-ND; RefSupplier2: *; RefSupplier3: *; Case: 0603; Material: NP0
C30 C62 C63 = 1uF 16V 0603 X7R: Tolerance: 10%; Voltage: 16V; Supplier1: Digikey; Supplier2: Mouser; Supplier3: Farnell; RefSupplier1: EMK107B7105KA-T; RefSupplier2: *; RefSupplier3: *; Case: 0603; Material: X7R
C48 C52 C60 = 10uF 6.3V 0603 X5R: Tolerance: 10%; Voltage: 6.3V; Supplier1: Digikey; Supplier2: Mouser; Supplier3: Farnell; RefSupplier1: 587-1256-1-ND; RefSupplier2: *; RefSupplier3: *; Case: 0603; Material: X5R
C49-C51 C53-C55 C57 C58 C76 = 100nF 25V 0603 X5R: Tolerance: 10%; Voltage: 25V; Supplier1: Digikey; Supplier2: Mouser; Supplier3: Farnell; RefSupplier1: 587-1245-1-ND; RefSupplier2: *; RefSupplier3: *; Case: 0603; Material: X5R
C61 C89 = 4.7nF 50V 0603 X7R: Tolerance: 10%; Voltage: 50V; Supplier1: Digikey; Supplier2: Mouser; Supplier3: Farnell; RefSupplier1: 490-12741-1-ND; RefSupplier2: *; RefSupplier3: *; Case: 0603; Material: X7R
D4 D5 = PRTR5V0U2AX,215: as D3 on sheet 02-ESP-WROOM-32; PartNumber: PRTR5V0U2AX,215; Case: SOT-143-B
J2 = SJ1-3524NG: SJ1-3524NG Jack 3.5mm Stereo; Manufacturer: CUI; PartNumber: SJ1-3524NG; Supplier1: Digikey; RefSupplier1: CP1-3524NG-ND
L9 = CMP-0220-00178-1: as L18 on sheet 02-ESP-WROOM-32; PackageDescription: Chip Inductor, 2-Leads, Body 1.6 x 0.8 mm; PackageVersion: 2009; PackageReference: SMD-0603; ComponentLink1URL: http://www.we-online.com; ComponentLink2URL: http://www.we-online.de/katalog/media/pdf/742792662.pdf; Impedance: 1000 Ohm; DatasheetVersion: ver 1, Mar-2010; ComponentLink1Description: Manufacturer Link; ComponentLink2Description: Datasheet; RefManufacturer: 742792662
M2 = TEA5767: FM Receiver 11x11mm TEA5767; PartNumber: MODULE_TEA5767
P2 = Wire_TH: 0.8mm Hole
R4 R12 R57 = 100k: Resistor 100k 0603 1%; Case: 0603; Tolerance: 1%; Supplier1: Digikey; Supplier2: *; Supplier3: *; RefSupplier1: 311-100KHRCT-ND; RefSupplier2: *; RefSupplier3: *
R5 R9 R10 R51 R58 = 10k: Resistor 10k 0603 1%; Case: 0603; Tolerance: 1%; Size: 0603, 1.6x0.8x0.8mm; RefSupplier1: 311-10.0KHRCT-ND; RefSupplier2: *; RefSupplier3: *; Supplier1: Digikey; Supplier2: *; Supplier3: *
R6 = 10R: Resistor 10R 0603 1%; Case: 0603; Tolerance: 1%; Size: 0603, 1.6x0.8x0.8mm; RefSupplier1: 311-10.0HRCT-ND; RefSupplier2: *; RefSupplier3: *; Supplier1: Digikey; Supplier2: *; Supplier3: *
R7 R8 = 20R: Resistor 20R 0603 1%; Case: 0603; Tolerance: 1%; Size: 0603, 1.6x0.8x0.8mm; RefSupplier1: 311-20.0HRCT-ND; RefSupplier2: *; RefSupplier3: *; Supplier1: Digikey; Supplier2: *; Supplier3: *
R11 = 1M: Resistor 1M 0603 1%; Case: 0603; Tolerance: 1%; Size: 0603, 1.6x0.8x0.8mm; Supplier1: Digikey; Supplier2: Mouser; Supplier3: Farnell; RefSupplier1: 311-1.00MHRCT-ND; RefSupplier2: *; RefSupplier3: *
TP1 = TP_1mm: Test point 1mm round SMD
U3 = VS1053: VS1053 DSP; PartNumber: VS1053b; Manufacturer: VLSI; Case: TQFP48
Y1 = HC49SDLF 12.288MHz: 12.2880MHz Crystal HC49 SMT 50ppm; PartNumber: FOXSDLF/128-20; Manufacturer: Fox Electronic; Value: 12.2880MHz; Tolerance: 50ppm; Case: HC49S

## Sheet 04-Ethernet.SchDoc: Ethernet PHY
size A3; Date: 01/01/2016; Author: Frédéric Renet; Organization: APTUSTECH; Address2: 8 Rue Esperandieu; Address3: 13004 Marseille; Address4: FRANCE; DocumentNumber: 123; Revision: 1.0; SheetNumber: 5; SheetTotal: 6
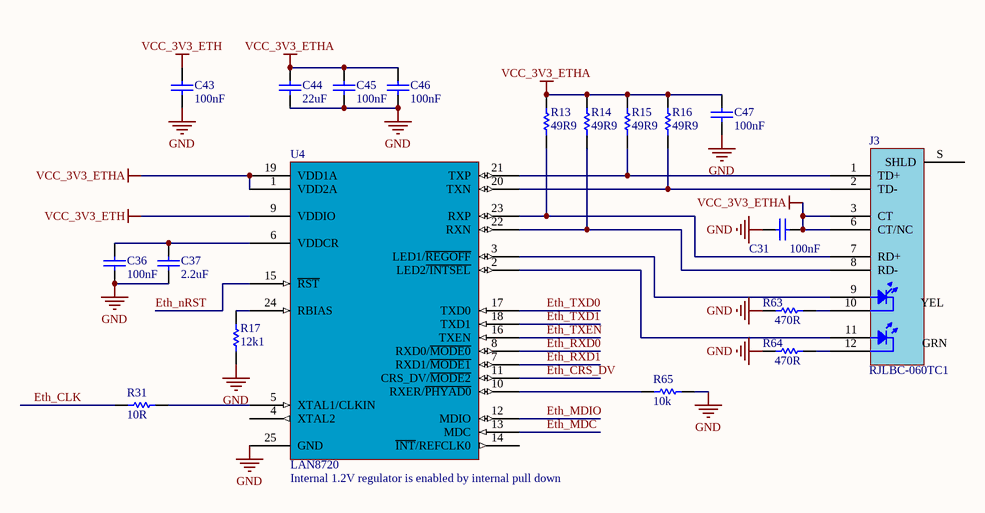
[diagram p4: 04-Ethernet.SchDoc]

### Parts
C31  value 100nF  [CAPC1608X06N]  (hidden comment: 100nF 25V 0603 X5R)
C36  value 100nF  [CAPC1608X06N]  (hidden comment: 100nF 25V 0603 X5R)
C37  value 2.2uF  [CAPC1608X06N]  (hidden comment: 2.2uF 10V 0603 X5R)
C43  value 100nF  [CAPC1608X06N]  (hidden comment: 100nF 25V 0603 X5R)
C44  value 22uF  [CAPC1608X06N]  (hidden comment: 22uF 6.3V 0603 X5R)
C45  value 100nF  [CAPC1608X06N]  (hidden comment: 100nF 25V 0603 X5R)
C46  value 100nF  [CAPC1608X06N]  (hidden comment: 100nF 25V 0603 X5R)
C47  value 100nF  [CAPC1608X06N]  (hidden comment: 100nF 25V 0603 X5R)
J3  RJLBC-060TC1  [RJLBC-060TC1]
R13  value 49R9  [RESC1608X06N]  (hidden comment: 49R9_0603)
R14  value 49R9  [RESC1608X06N]  (hidden comment: 49R9_0603)
R15  value 49R9  [RESC1608X06N]  (hidden comment: 49R9_0603)
R16  value 49R9  [RESC1608X06N]  (hidden comment: 49R9_0603)
R17  value 12k1  [RESC1608X06N]  (hidden comment: 12k1_0603)
R31  value 10R  [RESC1608X06N]  (hidden comment: 10R_0603)
R63  value 470R  [RESC1608X06N]  (hidden comment: 470R_0603)
R64  value 470R  [RESC1608X06N]  (hidden comment: 470R_0603)
R65  value 10k  [RESC1608X06N]  (hidden comment: 10k_0603)
U4  LAN8720  [QFN50P400X400X100_HS-25N]

### Nets
GND: C31.2 C36.2 C37.1 C43.2 C44.1 C45.2 C46.2 C47.2 R17.1 R63.1 R64.1 R65.1 U4.25(GND)
VCC_3V3_ETH: C43.1 U4.9(VDDIO)
VCC_3V3_ETHA: C31.1 C44.2 C45.1 C46.1 C47.1 J3.3(CT) J3.6(CT/NC) R13.2 R14.2 R15.2 R16.2 U4.1(VDD2A) U4.19(VDD1A)
Eth_CLK: R31.1
Eth_CRS_DV: U4.11(CRS_DV/~{MODE2})
Eth_MDC: U4.13(MDC)
Eth_MDIO: U4.12(MDIO)
Eth_nRST: U4.15(~{RST})
Eth_RXD0: U4.8(RXD0/~{MODE0})
Eth_RXD1: U4.7(RXD1/~{MODE1})
Eth_TXD0: U4.17(TXD0)
Eth_TXD1: U4.18(TXD1)
Eth_TXEN: U4.16(TXEN)
NetC36_1: C36.1 C37.2 U4.6(VDDCR)
NetJ3_1: J3.1(TD+) R15.1 U4.21(TXP)
NetJ3_2: J3.2(TD-) R16.1 U4.20(TXN)
NetJ3_7: J3.7(RD+) R13.1 U4.23(RXP)
NetJ3_8: J3.8(RD-) R14.1 U4.22(RXN)
NetJ3_9: J3.9(P9) U4.3(LED1/~{REGOFF})
NetJ3_10: J3.10(P10) R63.2
NetJ3_11: J3.11(P11) U4.2(LED2~{/INTSEL})
NetJ3_12: J3.12(P12) R64.2
NetR17_2: R17.2 U4.24(RBIAS)
NetR31_2: R31.2 U4.5(XTAL1/CLKIN)
NetR65_2: R65.2 U4.10(RXER/~{PHYAD0})

Not connected (* = marked no-connect by the designer): J3 S(SHLD); U4 4(XTAL2) 14(~{INT}/REFCLK0)

### Notes on the sheet
- (near U4) Internal 1.2V regulator is enabled by internal pull down
- Title
- Size:
- Date:
- A3
- Number:
- Author:
- Revision:
- Sheet
- of
- File:
- (in symbol RJLBC-060TC1) YEL; GRN

### Library data of the parts
C31 C36 C43 C45-C47 = 100nF 25V 0603 X5R: Tolerance: 10%; Voltage: 25V; Supplier1: Digikey; Supplier2: Mouser; Supplier3: Farnell; RefSupplier1: 587-1245-1-ND; RefSupplier2: *; RefSupplier3: *; Case: 0603; Material: X5R
C37 = 2.2uF 10V 0603 X5R: Tolerance: 10%; Voltage: 10V; Supplier1: Digikey; Supplier2: Mouser; Supplier3: Farnell; RefSupplier1: 1276-1085-1-ND; RefSupplier2: *; RefSupplier3: *; Case: 0603; Material: X5R
C44 = 22uF 6.3V 0603 X5R: Tolerance: 10%; Voltage: 6.3V; Supplier1: Digikey; Supplier2: Mouser; Supplier3: Farnell; RefSupplier1: 445-8028-2-ND; RefSupplier2: *; RefSupplier3: *; Case: 0603; Material: X5R
J3 = RJLBC-060TC1: Modular Jack with Magnetics Shield LEDS  RJLBC-060TC1; Manufacturer: TAIMAG; PartNumber: RJLBC-060TC1
R13-R16 = 49R9: Resistor 49R9 0603 1%; Case: 0603; Tolerance: 1%; Size: 0603, 1.6x0.8x0.8mm; RefSupplier1: 311-49.9HRCT-ND; RefSupplier2: *; RefSupplier3: *; Supplier1: Digikey; Supplier2: *; Supplier3: *
R17 = 12k1: Resistor 12k1 0603 1%; Case: 0603; Tolerance: 1%; Size: 0603, 1.6x0.8x0.8mm; RefSupplier1: 311-12.1KHRCT-ND; RefSupplier2: *; RefSupplier3: *; Supplier1: Digikey; Supplier2: *; Supplier3: *
R31 = 10R: Resistor 10R 0603 1%; Case: 0603; Tolerance: 1%; Size: 0603, 1.6x0.8x0.8mm; RefSupplier1: 311-10.0HRCT-ND; RefSupplier2: *; RefSupplier3: *; Supplier1: Digikey; Supplier2: *; Supplier3: *
R63 R64 = 470R: Resistor 470R 0603 1%; Case: 0603; Tolerance: 1%; Size: 0603, 1.6x0.8x0.8mm; Supplier1: Digikey; Supplier2: *; Supplier3: *; RefSupplier1: 311-470HRCT-ND; RefSupplier2: *; RefSupplier3: *
R65 = 10k: Resistor 10k 0603 1%; Case: 0603; Tolerance: 1%; Size: 0603, 1.6x0.8x0.8mm; RefSupplier1: 311-10.0KHRCT-ND; RefSupplier2: *; RefSupplier3: *; Supplier1: Digikey; Supplier2: *; Supplier3: *
U4 = LAN8720: LAN8720 RMII 10/100 Ethernet  Transceiver QFN24; PartNumber: LAN8720A-CP-ABC; Manufacturer: Microchip; Supplier1: Digikey; RefSupplier1: LAN8720A-CP-ABC-ND; Case: QFN24

## Sheet 05-Power.SchDoc: Power supplies
size A3; Date: 01/01/2016; Author: Frédéric Renet; Organization: APTUSTECH; Address2: 8 Rue Esperandieu; Address3: 13004 Marseille; Address4: FRANCE; DocumentNumber: 123; Revision: 1.0; SheetNumber: 6; SheetTotal: 6
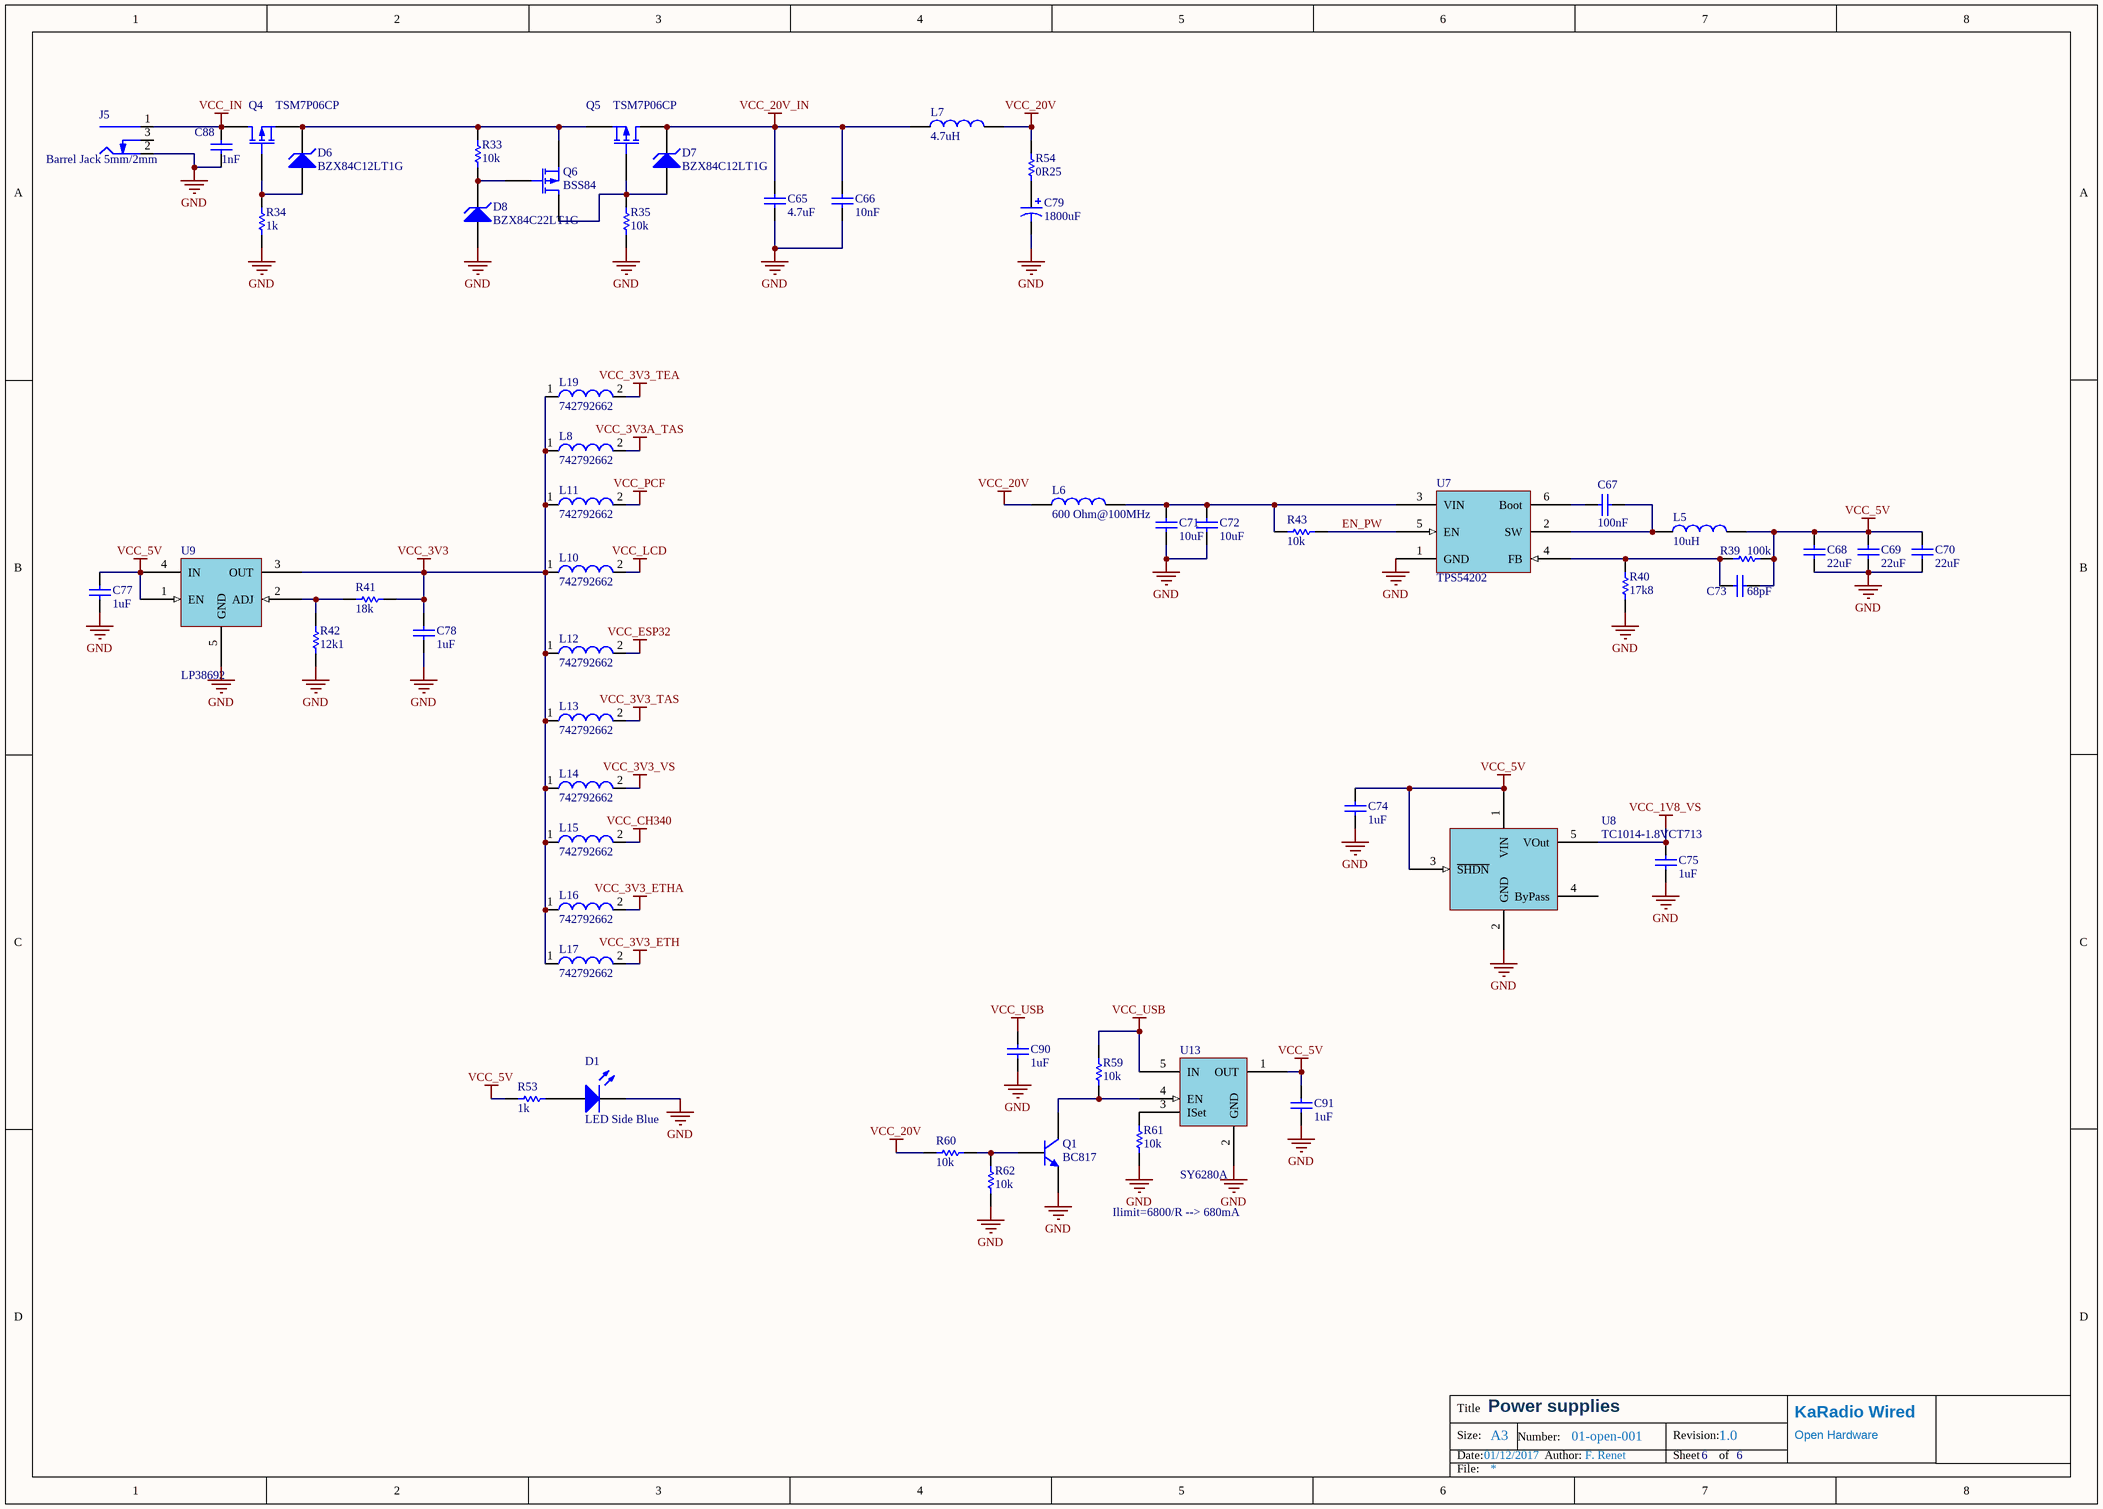
[diagram p5: 05-Power.SchDoc]

### Parts
C65  value 4.7uF  [CAPC3216X16N]  (hidden comment: 4.7uF 50V 1206 X5R)
C66  value 10nF  [CAPC1608X06N]  (hidden comment: 10nF 50V 0603 NP0)
C67  value 100nF  [CAPC2012X14N]  (hidden comment: 100nfF 10V 0805 X5R)
C68  value 22uF  [CAPC2012X14N]  (hidden comment: 22uF 10V 0805 X5R)
C69  value 22uF  [CAPC2012X14N]  (hidden comment: 22uF 10V 0805 X5R)
C70  value 22uF  [CAPC2012X14N]  (hidden comment: 22uF 10V 0805 X5R)
C71  value 10uF  [CAPC3216X16N]  (hidden comment: 10uF 50V 1206 X5R)
C72  value 10uF  [CAPC3216X16N]  (hidden comment: 10uF 50V 1206 X5R)
C73  value 68pF  [CAPC1608X06N]  (hidden comment: 68pF 50V 0603 NP0)
C74  value 1uF  [CAPC1608X06N]  (hidden comment: 1uF 16V 0603 X7R)
C75  value 1uF  [CAPC1608X06N]  (hidden comment: 1uF 16V 0603 X7R)
C77  value 1uF  [CAPC1608X06N]  (hidden comment: 1uF 16V 0603 X7R)
C78  value 1uF  [CAPC1608X06N]  (hidden comment: 1uF 16V 0603 X7R)
C79  value 1800uF  [Cap_POL_12.5mm_20mm_TH]  (hidden comment: 1800uF 25V)
C88  value 1nF  [CAPC3216X16N]  (hidden comment: 1nF 100V 1206 X7R)
C90  value 1uF  [CAPC1608X06N]  (hidden comment: 1uF 16V 0603 X7R)
C91  value 1uF  [CAPC1608X06N]  (hidden comment: 1uF 16V 0603 X7R)
D1  LED Side Blue  [APA1606]
D6  BZX84C12LT1G  [SOT95P230X110-3N]
D7  BZX84C12LT1G  [SOT95P230X110-3N]
D8  BZX84C22LT1G  [SOT95P230X110-3N]
J5  Barrel Jack 5mm/2mm  [CUI PJ-102AH]
L5  value 10uH  [SRN6045]  (hidden comment: SRN6045-100M)
L6  value 600 Ohm@100MHz  [IND2012X14N]  (hidden comment: 74279220601)
L7  value 4.7uH  [1255AY]  (hidden comment: 1255AY-4R7M=P3)
L8  742792662  [CAPC0603(1608)]
L10  742792662  [CAPC0603(1608)]
L11  742792662  [CAPC0603(1608)]
L12  742792662  [CAPC0603(1608)]
L13  742792662  [CAPC0603(1608)]
L14  742792662  [CAPC0603(1608)]
L15  742792662  [CAPC0603(1608)]
L16  742792662  [CAPC0603(1608)]
L17  742792662  [CAPC0603(1608)]
L19  742792662  [CAPC0603(1608)]
Q1  BC817  [SOT95P230X110-3N]
Q4  TSM7P06CP  [TO252]
Q5  TSM7P06CP  [TO252]
Q6  BSS84  [SOT95P230X110-3N]
R33  value 10k  [RESC1608X06N]  (hidden comment: 10k_0603)
R34  value 1k  [RESC1608X06N]  (hidden comment: 1k_0603)
R35  value 10k  [RESC1608X06N]  (hidden comment: 10k_0603)
R39  value 100k  [RESC1608X06N]  (hidden comment: 100k_0603)
R40  value 17k8  [RESC1608X06N]  (hidden comment: 17k8_0603)
R41  value 18k  [RESC1608X06N]  (hidden comment: 18k_0603)
R42  value 12k1  [RESC1608X06N]  (hidden comment: 12k1_0603)
R43  value 10k  [RESC1608X06N]  (hidden comment: 10k_0603)
R53  value 1k  [RESC1608X06N]  (hidden comment: 1k_0603)
R54  value 0R25  [RESC3116X07N]  (hidden comment: 0R25_1206)
R59  value 10k  [RESC1608X06N]  (hidden comment: 10k_0603)
R60  value 10k  [RESC1608X06N]  (hidden comment: 10k_0603)
R61  value 10k  [RESC1608X06N]  (hidden comment: 10k_0603)
R62  value 10k  [RESC1608X06N]  (hidden comment: 10k_0603)
U7  TPS54202  [SOT95P245X110-6N]
U8  TC1014-1.8VCT713  [SOT95P245X110-5N]
U9  LP38692  [SOT150P700X180-5N]
U13  SY6280A  [SOT95P245X110-5N]

### Nets
GND: C65.1 C66.1 C68.1 C69.1 C70.1 C71.1 C72.1 C74.1 C75.1 C77.1 C78.1 C79.2 C88.1 C90.1 C91.1 D1.1(K) D8.1(A) J5.2(Outer) Q1.2(E) R34.1 R35.1 R40.1 R42.1 R61.1 R62.2 U7.1(GND) U8.2(GND) U9.5(GND) U13.2(GND)
VCC_1V8_VS: C75.2 U8.5(VOut)
VCC_3V3: C78.2 L8.1 L10.1 L11.1 L12.1 L13.1 L14.1 L15.1 L16.1 L17.1 L19.1 R41.2 U9.3(OUT)
VCC_3V3_ETH: L17.2
VCC_3V3_ETHA: L16.2
VCC_3V3_TAS: L13.2
VCC_3V3_TEA: L19.2
VCC_3V3_VS: L14.2
VCC_3V3A_TAS: L8.2
VCC_5V: C68.2 C69.2 C70.2 C73.2 C74.2 C77.2 C91.2 L5.2 R39.2 R53.2 U8.1(VIN) U8.3(~{SHDN}) U9.1(EN) U9.4(IN) U13.1(OUT)
VCC_20V: L6.1 L7.2 R54.2 R60.2
VCC_20V_IN: C65.2 C66.2 D7.3(K) L7.1 Q5.2(D)
VCC_CH340: L15.2
VCC_ESP32: L12.2
VCC_IN: C88.2 J5.1(Centre) Q4.2(D)
VCC_LCD: L10.2
VCC_PCF: L11.2
VCC_USB: C90.2 R59.2 U13.5(IN)
EN_PW: R43.1 U7.5(EN)
NetC67_1: C67.1 U7.6(Boot)
NetC67_2: C67.2 L5.1 U7.2(SW)
NetC71_2: C71.2 C72.2 L6.2 R43.2 U7.3(VIN)
NetC73_1: C73.1 R39.1 R40.2 U7.4(FB)
NetC79_1: C79.1 R54.1
NetD1_2: D1.2(A) R53.1
NetD6_1: D6.1(A) Q4.1(G) R34.2
NetD6_3: D6.3(K) Q4.3(S) Q5.3(S) Q6.2(S) R33.2
NetD7_1: D7.1(A) Q5.1(G) Q6.3(D) R35.2
NetD8_3: D8.3(K) Q6.1(G) R33.1
NetQ1_1: Q1.1(B) R60.1 R62.1
NetQ1_3: Q1.3(C) R59.1 U13.4(EN)
NetR41_1: R41.1 R42.2 U9.2(ADJ)
NetR61_2: R61.2 U13.3(ISet)

Not connected (* = marked no-connect by the designer): J5 3(SW); U8 4(ByPass)

### Notes on the sheet
- Ilimit=6800/R --> 680mA
- Title
- Size:
- Date:
- A3
- Number:
- Author:
- Revision:
- Sheet
- of
- File:

### Library data of the parts
C65 = 4.7uF 50V 1206 X5R: Tolerance: 10%; Voltage: 50V; Supplier1: Digikey; Supplier2: Mouser; Supplier3: Farnell; RefSupplier1: 587-2994-1-ND; RefSupplier2: *; RefSupplier3: *; Case: 1206; Material: X5R
C66 = 10nF 50V 0603 NP0: Tolerance: 10%; Voltage: 50V; Supplier1: Digikey; Supplier2: Mouser; Supplier3: Farnell; RefSupplier1: 490-9666-1-ND; RefSupplier2: *; RefSupplier3: *; Case: 0603; Material: NP0
C67 = 100nF 50V 0805 X5R_1: 100nF 50V 0805 X5R; Tolerance: 10%; Voltage: 50V; Supplier1: Digikey; Supplier2: Mouser; Supplier3: Farnell; RefSupplier2: *; RefSupplier3: *; Case: 0805; Material: X5R
C68-C70 = 22uF 10V 0805 X5R: Tolerance: 10%; Voltage: 10V; Supplier1: Digikey; Supplier2: Mouser; Supplier3: Farnell; RefSupplier1: 490-10511-1-ND; RefSupplier2: *; RefSupplier3: *; Case: 0805; Material: X5R
C71 C72 = 10uF 50V 1206 X5R: Tolerance: 10%; Voltage: 50V; Supplier1: Digikey; Supplier2: Mouser; Supplier3: Farnell; RefSupplier1: 1276-6736-1-ND; RefSupplier2: *; RefSupplier3: *; Case: 1206; Material: X5R
C73 = 68pF 50V 0603 NP0: Tolerance: 10%; Voltage: 50V; Supplier1: Digikey; Supplier2: Mouser; Supplier3: Farnell; RefSupplier1: 490-11301-1-ND; RefSupplier2: *; RefSupplier3: *; Case: 0603; Material: NP0
C74 C75 C77 C78 C90 C91 = 1uF 16V 0603 X7R: Tolerance: 10%; Voltage: 16V; Supplier1: Digikey; Supplier2: Mouser; Supplier3: Farnell; RefSupplier1: EMK107B7105KA-T; RefSupplier2: *; RefSupplier3: *; Case: 0603; Material: X7R
C79 = 1800uF 25V 12.5mm 20mm: Aluminum Capacitor 1800uF 25V TH 12.5mm 20mm; PartNumber: EGXF250ELL182MK20S; Manufacturer: United Chemi-Con; Tolerance: 20%; Voltage: 25V; Supplier1: Mouser; RefSupplier1: 661-EGXF250ELL182MK2
C88 = 1nF 100V 1206 X7R: Tolerance: 10%; Voltage: 100V; Supplier1: Digikey; Supplier2: Mouser; Supplier3: Farnell; RefSupplier2: 77-VJ1206Y102JXBAC; RefSupplier3: *; Case: 1206; Material: X7R
D1 = LED Side Blue: Side Emitting LED Blue; Manufacturer: Kingbtigth; PartNumber: APA1606QBC/D
D6 D7 = BZX84C12LT1G: DIODE ZENER 12V 250MW SOT23-3; Manufacturer: ON Semi; Supplier1: Digikey; PartNumber: BZX84C12LT1G; RefSupplier1: BZX84C12LT1GOSCT-ND; Case: SOT23
D8 = BZX84C22LT1G: DIODE ZENER 22V 250MW SOT23-3; Manufacturer: ON Semi; Supplier1: Digikey; PartNumber: BZX84C22LT1G; RefSupplier1: BZX84C22LT1GOSTR-ND; Case: SOT23
J5 = Barrel Connector: CONN PWR JACK 2X5.5MM SOLDER; PartNumber: PJ-102AH; Manufacturer: CUI; Supplier1: Digikey; RefSupplier1: CP-102AH-ND
L5 = SRN6045-100M: SRN6045-100M 10uH 2.5A 6x6x4,5mm; Manufacturer: Bourns; PartNumber: SRN6045-100M; Rated Current: 2.5A; Case: 6045; Supplier1: Digikey; Supplier2: Mouser; Supplier3: Farnell; RefSupplier2: *; RefSupplier3: *
L6 = 74279220601: 0805, 600 Ohm@100MHz, 2.1A; Manufacturer: Wurth; PartNumber: 74279220601; Size: 0805; Supplier1: Digikey; RefSupplier1: 732-6126-1-ND
L7 = 1255AY-4R7M=P3: 1255AY-4R7M=P3 4.7uH 4A; Manufacturer: Murata; PartNumber: 1255AY-4R7M=P3; Rated Current: 4A; Case: 2424; Supplier1: Digikey; Supplier2: Mouser; Supplier3: Farnell; RefSupplier2: *; RefSupplier3: *
L8 L10-L17 L19 = CMP-0220-00178-1: as L18 on sheet 02-ESP-WROOM-32; PackageDescription: Chip Inductor, 2-Leads, Body 1.6 x 0.8 mm; PackageVersion: 2009; PackageReference: SMD-0603; ComponentLink1URL: http://www.we-online.com; ComponentLink2URL: http://www.we-online.de/katalog/media/pdf/742792662.pdf; Impedance: 1000 Ohm; DatasheetVersion: ver 1, Mar-2010; ComponentLink1Description: Manufacturer Link; ComponentLink2Description: Datasheet; PartNumber: 742792662
Q1 = BC817_SOT23: as Q2 on sheet 02-ESP-WROOM-32; Case: SOT23; Supplier1: Digikey; RefSupplier1: 1727-2919-1-ND
Q4 Q5 = TSM7P06CP: MOSFET P-CHANNEL 60V 7A TO252; Manufacturer: Taiwan Semiconductor Corp; PartNumber: TSM7P06CP; Supplier1: Digikey; RefSupplier1: TSM7P06CP ROGCT-ND
Q6 = BSS84: MOSFET P-CH 60V 170MA SOT-23; PartNumber: BSS84PH6433XTMA1; Manufacturer: Infineon; Supplier1: Digikey; RefSupplier1: BSS84PH6433XTMA1TR-ND
R33 R35 R43 R59-R62 = 10k: Resistor 10k 0603 1%; Case: 0603; Tolerance: 1%; Size: 0603, 1.6x0.8x0.8mm; RefSupplier1: 311-10.0KHRCT-ND; RefSupplier2: *; RefSupplier3: *; Supplier1: Digikey; Supplier2: *; Supplier3: *
R34 R53 = 1k: Resistor 1k 0603 1%; Case: 0603; Tolerance: 1%; Size: 0603, 1.6x0.8x0.8mm; Supplier1: Digikey; Supplier2: Mouser; Supplier3: Farnell; RefSupplier1: 311-1.00KHRCT-ND; RefSupplier2: *; RefSupplier3: *
R39 = 100k: Resistor 100k 0603 1%; Case: 0603; Tolerance: 1%; Supplier1: Digikey; Supplier2: *; Supplier3: *; RefSupplier1: 311-100KHRCT-ND; RefSupplier2: *; RefSupplier3: *
R40 = 17k8: Resistor 17k8 0603 1%; Case: 0603; Tolerance: 1%; Supplier1: Digikey; Supplier2: *; Supplier3: *; RefSupplier1: 311-17.8KHRTR-ND; RefSupplier2: *; RefSupplier3: *
R41 = 18k: Resistor 18k 0603 1%; Case: 0603; Tolerance: 1%; Size: 0603, 1.6x0.8x0.8mm; RefSupplier1: 311-18.0KHRCT-ND; RefSupplier2: *; RefSupplier3: *; Supplier1: Digikey; Supplier2: *; Supplier3: *
R42 = 12k1: Resistor 12k1 0603 1%; Case: 0603; Tolerance: 1%; Size: 0603, 1.6x0.8x0.8mm; RefSupplier1: 311-12.1KHRCT-ND; RefSupplier2: *; RefSupplier3: *; Supplier1: Digikey; Supplier2: *; Supplier3: *
R54 = 0R25_1206: Resistor 0.25R 1206 1%; Case: 1206; Tolerance: 1%; Size: 1206, 3.2x1.6x0.8mm; Supplier1: Digikey; Supplier2: Mouser; Supplier3: Farnell; RefSupplier2: 603-PT1206FR-070R25L; RefSupplier3: *
U7 = TPS54202: 4.5V to 28V Input, 2A Output Sync Buck; PartNumber: TPS54202DDC; Manufacturer: TI; Case: SOT23-6
U8 = TC1014-1.8VCT713: 1.8V LDO 50mA SOT23-5; Manufacturer: Microchip; PartNumber: TC1014-1.8VCT713; Case: SOT23-5
U9 = LP38692MP-ADJ/NOPB: REG LIN POS ADJ 1A SOT223-5 LP38692MP-ADJ/NOPB; Manufacturer: TI; PartNumber: LP38692MP-ADJ/NOPB; Case: SOT223-5
U13 = SY6280A: SOT23-5 USB VCC Switch with current Limit; Manufacturer: Silergy; PartNumber: SY6280A; Case: SOT23-5